# Altium project PPC_notebook_electrical_schematics_v0.6.PrjPcb (part 3 of 10)

## Sheet 09 USB.SchDoc
size 420 x 297 mm
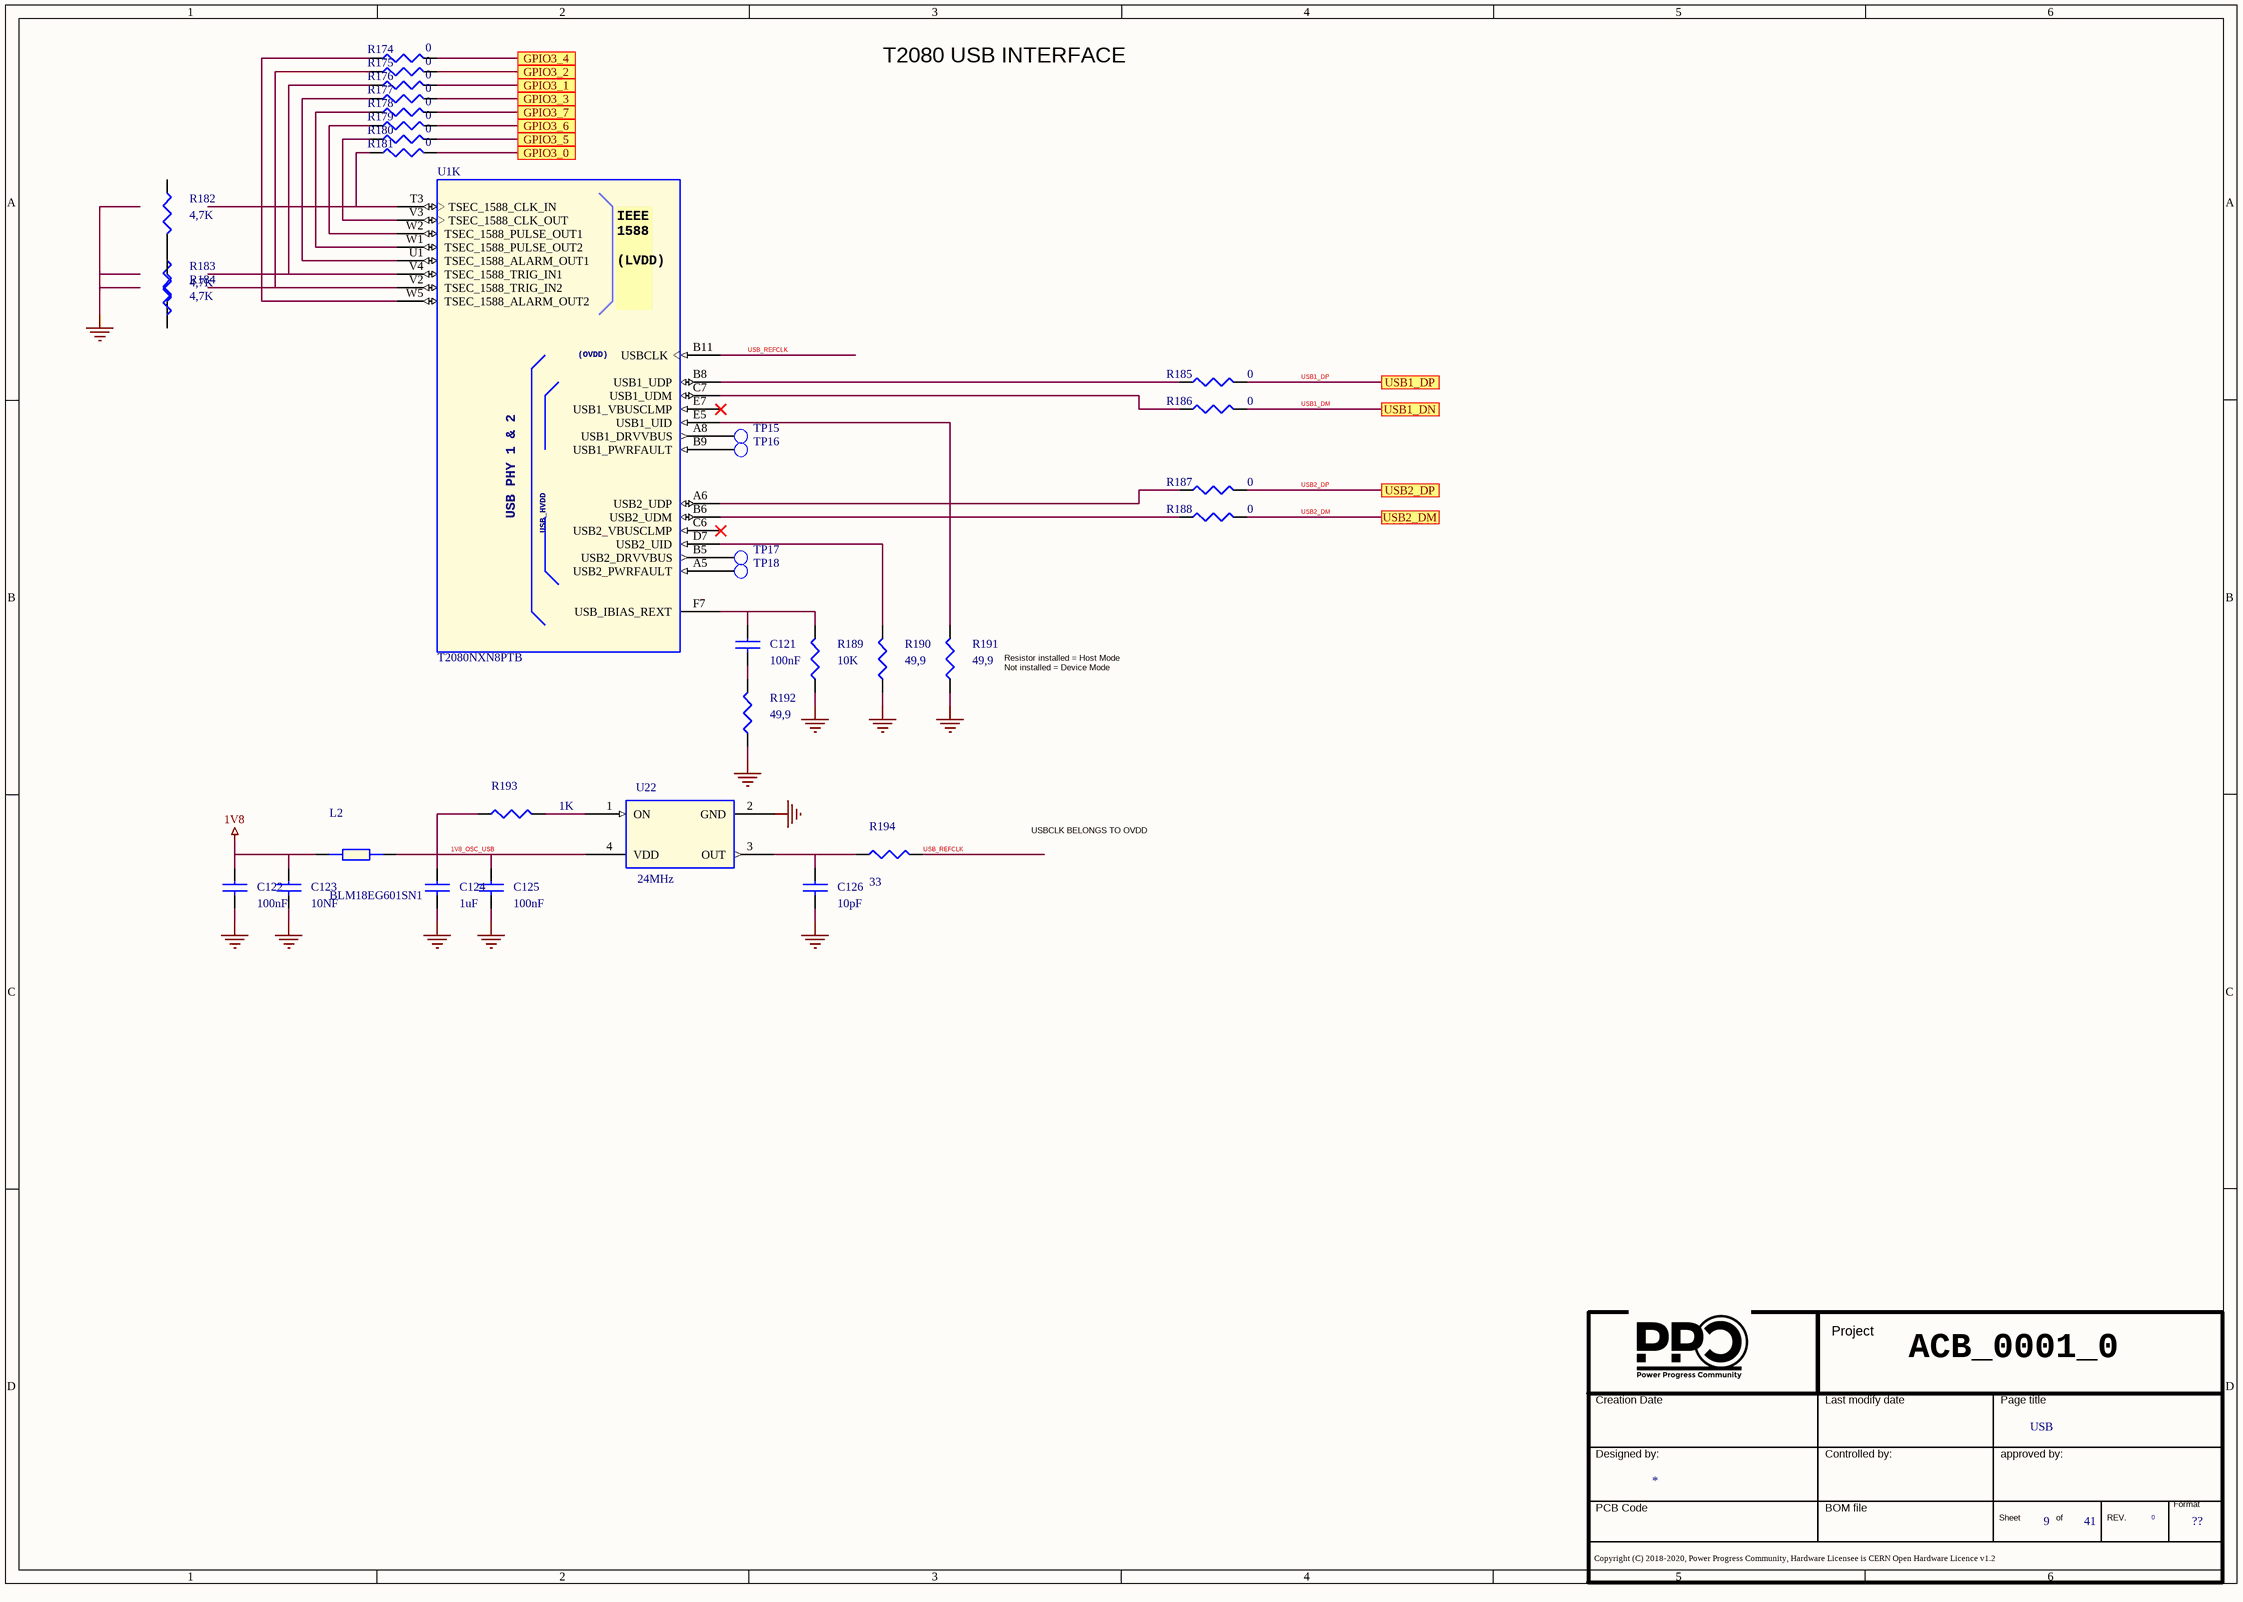
[diagram p20: 09 USB.SchDoc]

### Parts
(Parts that share a designator on the sheet are numbered #1, #2 ... from top to bottom, then left to right.)
*#13  Doc: USB  Page Count: 41  Page Number: 9  Page Size: ??  RevCode: 0  (hidden comment: Title_block_PPC)  (graphical)
C121  100nF  [SMD_0402]
C122  100nF  [SMD_0402]
C123  10NF  [SMD_0402]
C124  1uF  [SMD_0402]
C125  100nF  [SMD_0402]
C126  10pF  [SMD_0402]
L2  BLM18EG601SN1  [SMD_0603]
R174  0  [SMD_0402]
R175  0  [SMD_0402]
R176  0  [SMD_0402]
R177  0  [SMD_0402]
R178  0  [SMD_0402]
R179  0  [SMD_0402]
R180  0  [SMD_0402]
R181  0  [SMD_0402]
R182  4,7K  [SMD_0402]
R183  4,7K  [SMD_0402]
R184  4,7K  [SMD_0402]
R185  0  [SMD_0402]
R186  0  [SMD_0402]
R187  0  [SMD_0402]
R188  0  [SMD_0402]
R189  10K  [SMD_0402]
R190  49,9  [SMD_0402]
R191  49,9  [SMD_0402]
R192  49,9  [SMD_0402]
R193  1K  [SMD_0402]
R194  33  [SMD_0402]
TP15  TEST POINT  [PCB]  (value not drawn)
TP16  TEST POINT  [PCB]  (value not drawn)
TP17  TEST POINT  [PCB]  (value not drawn)
TP18  TEST POINT  [PCB]  (value not drawn)
U1  T2080NXN8PTB  [bga]  (part K of 14)
U22  24MHz  [4 PIN SMT]

### Ports
GPIO3_0, GPIO3_1, GPIO3_2, GPIO3_3, GPIO3_4, GPIO3_5, GPIO3_6, GPIO3_7, USB1_DN, USB1_DP, USB2_DM, USB2_DP

### Nets
1V8: C122.1 C123.1 L2.1
GND: C122.2 C123.2 C124.2 C125.2 C126.2 R189.1 R190.1 R191.1 R192.1 U22.2(GND)
1V8_OSC_USB: C124.1 C125.1 L2.2 R193.1 U22.4(VDD)
USB1_DM: R186.2 ; port USB1_DN
USB1_DP: R185.2 ; port USB1_DP
USB2_DM: R188.2 ; port USB2_DM
USB2_DP: R187.2 ; port USB2_DP
USB_REFCLK: R194.2 U1.B11(USBCLK)
NetC121_1: C121.1 R189.2 U1.F7(USB_IBIAS_REXT)
NetC121_2: C121.2 R192.2
NetC126_1: C126.1 R194.1 U22.3(OUT)
NetR174_1: R174.1 U1.W5(TSEC_1588_ALARM_OUT2)
NetR174_2: R174.2 ; port GPIO3_4
NetR175_1: R175.1 U1.V2(TSEC_1588_TRIG_IN2)
NetR175_2: R175.2 ; port GPIO3_2
NetR176_1: R176.1 U1.V4(TSEC_1588_TRIG_IN1)
NetR176_2: R176.2 ; port GPIO3_1
NetR177_1: R177.1 U1.U1(TSEC_1588_ALARM_OUT1)
NetR177_2: R177.2 ; port GPIO3_3
NetR178_1: R178.1 U1.W1(TSEC_1588_PULSE_OUT2)
NetR178_2: R178.2 ; port GPIO3_7
NetR179_1: R179.1 U1.W2(TSEC_1588_PULSE_OUT1)
NetR179_2: R179.2 ; port GPIO3_6
NetR180_1: R180.1 U1.V3(TSEC_1588_CLK_OUT)
NetR180_2: R180.2 ; port GPIO3_5
NetR181_1: R181.1 U1.T3(TSEC_1588_CLK_IN)
NetR181_2: R181.2 ; port GPIO3_0
NetR182_2: R182.2 R183.1
NetR185_1: R185.1 U1.B8(USB1_UDP)
NetR186_1: R186.1 U1.C7(USB1_UDM)
NetR187_1: R187.1 U1.A6(USB2_UDP)
NetR188_1: R188.1 U1.B6(USB2_UDM)
NetR190_2: R190.2 U1.D7(USB2_UID)
NetR191_2: R191.2 U1.E5(USB1_UID)
NetR193_2: R193.2 U22.1(ON)
NetTP15_1: TP15.1(TP) U1.A8(USB1_DRVVBUS)
NetTP16_1: TP16.1(TP) U1.B9(USB1_PWRFAULT)
NetTP17_1: TP17.1(TP) U1.B5(USB2_DRVVBUS)
NetTP18_1: TP18.1(TP) U1.A5(USB2_PWRFAULT)

Not connected (* = marked no-connect by the designer): R182 1; R183 2; R184 1 2; U1 C6(USB2_VBUSCLMP)* E7(USB1_VBUSCLMP)*

### Notes on the sheet
- T2080 USB INTERFACE
- Resistor installed = Host Mode
  Not installed = Device Mode
- USBCLK BELONGS TO OVDD
- ACB_0001_0
- (in symbol T2080, part K) IEEE 1588 / (LVDD); (OVDD); USB PHY 1 & 2; USB_HVDD

### Library data of the parts
*#13 = Title_block_PPC: Title: T2080PCIe; Schematic Page Count: 45; Schematic Page Number: 10; Author: MICETEK; Page Create Date: March  8, 1995; Page Title: ?; Page Modify Date: *
C121 = CAP NP_Dup2: as C74-C83 on sheet 07 SYS; Part Type: Capacitors\Ceramic\SMD\0402; PCB Footprint: SMD_0402
C122 C125 = CAP NP_Dup2: as C70-C73 on sheet 07 SYS; PCB Footprint: SMD_0402; Part Type: Capacitors\Ceramic\SMD\0402
C123 = CAP NP_Dup2: COND.CER. 10NF 16V 0402 X7R SMD; Part Number: PASSIVE_28; Manufacturer 1: AVX; Manufacturer Part Number 1: 0402YC103KAT2A; RSM: RC0402; Part Type: Capacitors\Ceramic\SMD\0402; PCB Footprint: SMD_0402
C124 = CAP NP_Dup2: CAP CER 1UF 25V X6S 0402; Part Number: PASSIVE_1446; Manufacturer 1: Murata; Manufacturer Part Number 1: GRM155C81E105KE11D; RSM: RC0402; Part Type: Capacitors\Ceramic\SMD\0402; PCB Footprint: SMD_0402
C126 = CAP NP_Dup2: COND.CER.10PF 50V 0402 NPO/COG SMD; Manufacturer Part Number 1: GRM1555C1H100JZ01D; Manufacturer 1: Murata; Part Number: PASSIVE_32; RSM: RC0402; Part Type: Capacitors\Ceramic\SMD\0402; PCB Footprint: SMD_0402
L2 = FERRITE_BEAD: as L3 on sheet 09A_USB_HUB; Part Type: Ferrite Beads\SMD\0603; PCB Footprint: SMD_0603
R174-R181 R185-R188 = R_Dup5: as R102 on sheet 07 SYS; Part Type: Resistors\Fixed\SMD\0402\5%; Manufacturer Part Number 1: RESIS.CHIP 0R 5% 0402 SMD; PCB Footprint: SMD_0402
  R174-R181: Distributor 1: CAMEL ELETTRONICA SRL  #
R182-R184 = R_Dup5: as R77-R94 on sheet 07 SYS; Part Type: Resistors\Fixed\SMD\0402\5%; PCB Footprint: SMD_0402; Manufacturer Part Number 1: RESIS.CHIP 4,7K 5% 0402 SMD
R189 = R_Dup5: as R114 on sheet 07 SYS; Manufacturer Part Number 1: RESIS.CHIP 10K 1% 0402 SMD; Part Type: Resistors\Fixed\SMD\0402\1%; PCB Footprint: SMD_0402
R190-R192 = R_Dup5: RESIS.CHIP 49,9R 1% 0402 SMD; Manufacturer Part Number 1: NCR04F49R9TRF; Manufacturer 1: NIC; Part Number: PASSIVE_738; RSM: RC0402; Part Type: Resistors\Fixed\SMD\0402\1%; PCB Footprint: SMD_0402
R193 = R_Dup5: as R97 on sheet 07 SYS; Part Type: Resistors\Fixed\SMD\0402\1%; Manufacturer Part Number 1: RESIS.CHIP 1K 1% 0402 SMD; PCB Footprint: SMD_0402
R194 = R_Dup5: RESIS.CHIP 33R 5% 0402 SMD; Part Number: PASSIVE_853; Manufacturer 1: ROYAL OHM; RSM: RC0402; Part Type: Resistors\Fixed\SMD\0402\5%; Manufacturer Part Number 1: RESIS.CHIP 33R 5% 0402 SMD; PCB Footprint: SMD_0402
TP15-TP18 = T POINT R: as TP19-TP21 on sheet 09B KEYBOARD; PCB Footprint: PCB; Part Type: Tpoint
U1 = T2080: QRIQ MPU 1.87GT/s DDR3/3L 4x10GE; Manufacturer 1: NXP; Part Number: MICROPROCESSOR_65; PCB Footprint: BGA896; Vendor: Freescale; RSM: PBGA896-0_8MM-26X25; Distributor 1: MOUSER(841-T2080NXN8PTB); Manufacturer Part Number 1: T2080NXN8PTB; Part Type: 32 BIT; TYPE: IC; MPN: T2080
U22 = OSCILLATOR: OSCILLATOR 24.000MHZ 1.8-3.3V 50ppm SMD; Part Number: MISC_87; Manufacturer 1: ABRACOM; Manufacturer Part Number 1: ASFLMB-24.000MHZ-LC-T; PCB Footprint: SMD_5.0x3.2; RSM: XC-ABM3B; Part Type: Oscillator; Distributor 1: DIGIKEY(535-11768-1-ND)

## Sheet 10B_WRAPPER.SchDoc
size 420 x 297 mm
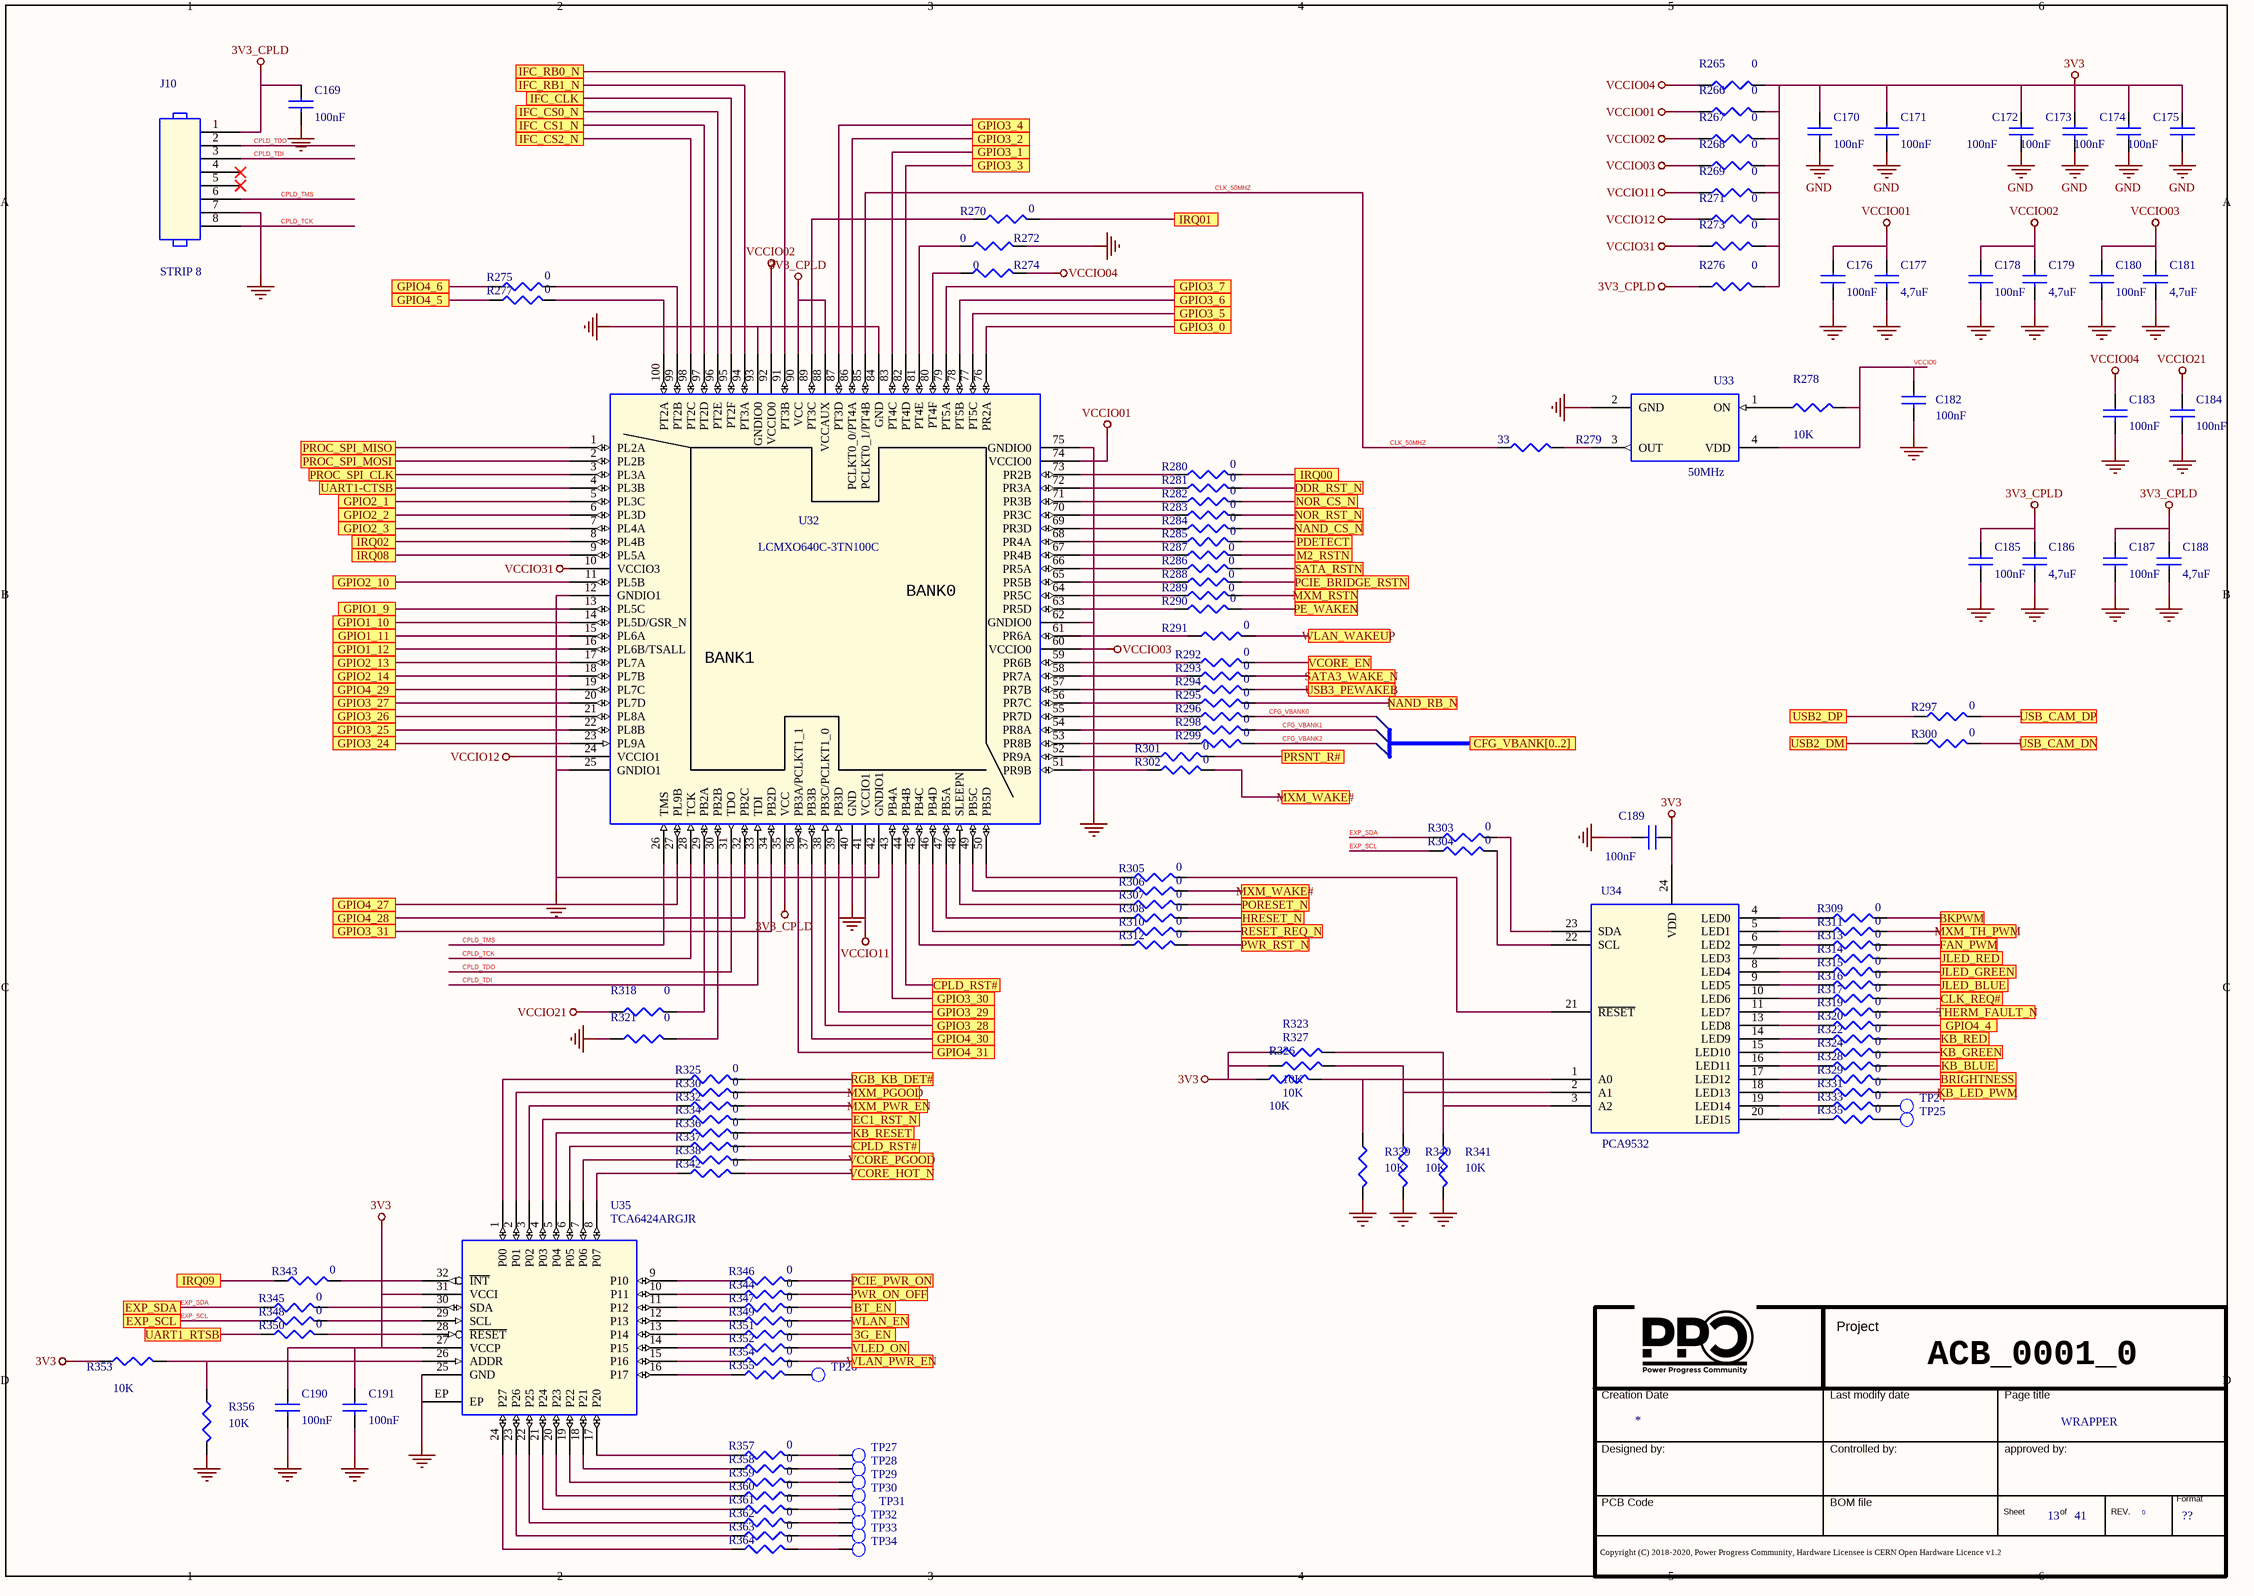
[diagram p21: 10B_WRAPPER.SchDoc]

### Parts
(Parts that share a designator on the sheet are numbered #1, #2 ... from top to bottom, then left to right.)
*#14  Doc: WRAPPER  Page Count: 41  Page Number: 13  Page Size: ??  RevCode: 0  (hidden comment: Title_block_PPC)  (graphical)
C169  100nF  [SMD_0402]
C170  100nF  [SMD_0402]
C171  100nF  [SMD_0402]
C172  100nF  [SMD_0402]
C173  100nF  [SMD_0402]
C174  100nF  [SMD_0402]
C175  100nF  [SMD_0402]
C176  100nF  [SMD_0402]
C177  4,7uF  [SMD_0603]
C178  100nF  [SMD_0402]
C179  4,7uF  [SMD_0603]
C180  100nF  [SMD_0402]
C181  4,7uF  [SMD_0603]
C182  100nF  [SMD_0402]
C183  100nF  [SMD_0402]
C184  100nF  [SMD_0402]
C185  100nF  [SMD_0402]
C186  4,7uF  [SMD_0603]
C187  100nF  [SMD_0402]
C188  4,7uF  [SMD_0603]
C189  100nF  [SMD_0402]
C190  100nF  [SMD_0402]
C191  100nF  [SMD_0402]
J10  STRIP 8  [PTH]
R265  0  [SMD_0402]
R266  0  [SMD_0402]
R267  0  [SMD_0402]
R268  0  [SMD_0402]
R269  0  [SMD_0402]
R270  0  [SMD_0402]
R271  0  [SMD_0402]
R272  0  [SMD_0402]
R273  0  [SMD_0402]
R274  0  [SMD_0402]
R275  0  [SMD_0402]
R276  0  [SMD_0402]
R277  0  [SMD_0402]
R278  10K  [SMD_0402]
R279  33  [SMD_0402]
R280  0  [SMD_0402]
R281  0  [SMD_0402]
R282  0  [SMD_0402]
R283  0  [SMD_0402]
R284  0  [SMD_0402]
R285  0  [SMD_0402]
R286  0  [SMD_0402]
R287  0  [SMD_0402]
R288  0  [SMD_0402]
R289  0  [SMD_0402]
R290  0  [SMD_0402]
R291  0  [SMD_0402]
R292  0  [SMD_0402]
R293  0  [SMD_0402]
R294  0  [SMD_0402]
R295  0  [SMD_0402]
R296  0  [SMD_0402]
R297  0  [SMD_0402]
R298  0  [SMD_0402]
R299  0  [SMD_0402]
R300  0  [SMD_0402]
R301  0  [SMD_0402]
R302  0  [SMD_0402]
R303  0  [SMD_0402]
R304  0  [SMD_0402]
R305  0  [SMD_0402]
R306  0  [SMD_0402]
R307  0  [SMD_0402]
R308  0  [SMD_0402]
R309  0  [SMD_0402]
R310  0  [SMD_0402]
R311  0  [SMD_0402]
R312  0  [SMD_0402]
R313  0  [SMD_0402]
R314  0  [SMD_0402]
R315  0  [SMD_0402]
R316  0  [SMD_0402]
R317  0  [SMD_0402]
R318  0  [SMD_0402]
R319  0  [SMD_0402]
R320  0  [SMD_0402]
R321  0  [SMD_0402]
R322  0  [SMD_0402]
R323  10K  [SMD_0402]
R324  0  [SMD_0402]
R325  0  [SMD_0402]
R326  10K  [SMD_0402]
R327  10K  [SMD_0402]
R328  0  [SMD_0402]
R329  0  [SMD_0402]
R330  0  [SMD_0402]
R331  0  [SMD_0402]
R332  0  [SMD_0402]
R333  0  [SMD_0402]
R334  0  [SMD_0402]
R335  0  [SMD_0402]
R336  0  [SMD_0402]
R337  0  [SMD_0402]
R338  0  [SMD_0402]
R339  10K  [SMD_0402]
R340  10K  [SMD_0402]
R341  10K  [SMD_0402]
R342  0  [SMD_0402]
R343  0  [SMD_0402]
R344  0  [SMD_0402]
R345  0  [SMD_0402]
R346  0  [SMD_0402]
R347  0  [SMD_0402]
R348  0  [SMD_0402]
R349  0  [SMD_0402]
R350  0  [SMD_0402]
R351  0  [SMD_0402]
R352  0  [SMD_0402]
R353  10K  [SMD_0402]
R354  0  [SMD_0402]
R355  0  [SMD_0402]
R356  10K  [SMD_0402]
R357  0  [SMD_0402]
R358  0  [SMD_0402]
R359  0  [SMD_0402]
R360  0  [SMD_0402]
R361  0  [SMD_0402]
R362  0  [SMD_0402]
R363  0  [SMD_0402]
R364  0  [SMD_0402]
TP24  TEST POINT  [PCB]  (value not drawn)
TP25  TEST POINT  [PCB]  (value not drawn)
TP26  TEST POINT  [PCB]  (value not drawn)
TP27  TEST POINT  [PCB]  (value not drawn)
TP28  TEST POINT  [PCB]  (value not drawn)
TP29  TEST POINT  [PCB]  (value not drawn)
TP30  TEST POINT  [PCB]  (value not drawn)
TP31  TEST POINT  [PCB]  (value not drawn)
TP32  TEST POINT  [PCB]  (value not drawn)
TP33  TEST POINT  [PCB]  (value not drawn)
TP34  TEST POINT  [PCB]  (value not drawn)
U32  LCMXO640C-3TN100C  [TQFP-100]
U33  50MHz  [4 PIN SMT]
U34  PCA9532  [TSSOP24]
U35  TCA6424ARGJR  [QFN32]

### Ports
3G_EN, BKPWM, BRIGHTNESS, BT_EN, CFG_VBANK[0..2], CLK_REQ#, CPLD_RST#, DDR_RST_N, EC1_RST_N, EXP_SCL, EXP_SDA, FAN_PWM, GPIO1_9, GPIO1_10, GPIO1_11, GPIO1_12, GPIO2_1, GPIO2_2, GPIO2_3, GPIO2_10, GPIO2_13, GPIO2_14, GPIO3_0, GPIO3_1, GPIO3_2, GPIO3_3, GPIO3_4, GPIO3_5, GPIO3_6, GPIO3_7, GPIO3_24, GPIO3_25, GPIO3_26, GPIO3_27, GPIO3_28, GPIO3_29, GPIO3_30, GPIO3_31, GPIO4_4, GPIO4_5, GPIO4_6, GPIO4_27, GPIO4_28, GPIO4_29, GPIO4_30, GPIO4_31, HRESET_N, IFC_CLK, IFC_CS0_N, IFC_CS1_N, IFC_CS2_N, IFC_RB0_N, IFC_RB1_N, IRQ00, IRQ01, IRQ02, IRQ08, IRQ09, JLED_BLUE, JLED_GREEN, JLED_RED, KB_BLUE, KB_GREEN, KB_LED_PWM, KB_RED, KB_RESET, M2_RSTN, MXM_PGOOD, MXM_PWR_EN, MXM_RSTN, MXM_TH_PWM, MXM_WAKE#, NAND_CS_N, NAND_RB_N, NOR_CS_N, NOR_RST_N, PCIE_BRIDGE_RSTN, PCIE_PWR_ON, PDETECT, PE_WAKEN, PORESET_N, PROC_SPI_CLK, PROC_SPI_MISO, PROC_SPI_MOSI, PRSNT_R#, PWR_ON_OFF, PWR_RST_N, RESET_REQ_N, RGB_KB_DET#, SATA3_WAKE_N, SATA_RSTN, THERM_FAULT_N, UART1-CTSB, UART1_RTSB, USB2_DM, USB2_DP, USB3_PEWAKEB, USB_CAM_DN, USB_CAM_DP, VCORE_EN, VCORE_HOT_N, VCORE_PGOOD, VLED_ON, WLAN_EN, WLAN_PWR_EN, WLAN_WAKEUP

### Nets
3V3: C170.1 C171.1 C172.1 C173.1 C174.1 C175.1 C189.1 C190.1 C191.1 R265.2 R266.2 R267.2 R268.2 R269.2 R271.2 R273.2 R276.2 R323.1 R326.1 R327.1 R353.1 U34.24(VDD) U35.27(VCCP) U35.31(VCCI)
3V3_CPLD: C169.1 C185.1 C186.1 C187.1 C188.1 J10.1 R276.1 U32.35(VCC) U32.88(VCCAUX) U32.90(VCC)
GND: C170.2 C171.2 C172.2 C173.2 C174.2 C175.2 C182.2 C189.2 C190.2 C191.2 R339.2 R340.2 R341.2 R356.2 U33.2(GND) U35.25(GND) U35.EP
GND_SIGNAL: C169.2 C176.2 C177.2 C178.2 C179.2 C180.2 C181.2 C183.2 C184.2 C185.2 C186.2 C187.2 C188.2 J10.7 R272.1 R321.1 U32.12(GNDIO1) U32.25(GNDIO1) U32.40(GND) U32.42(GNDIO1) U32.62(GNDIO0) U32.75(GNDIO0) U32.84(GND) U32.93(GNDIO0)
VCCIO01: C176.1 C177.1 R266.1 U32.74(VCCIO0)
VCCIO02: C178.1 C179.1 R267.1 U32.92(VCCIO0)
VCCIO03: C180.1 C181.1 R268.1 U32.60(VCCIO0)
VCCIO04: C183.1 R265.1 R274.1
VCCIO11: R269.1 U32.41(VCCIO1)
VCCIO12: R271.1 U32.24(VCCIO1)
VCCIO21: C184.1 R318.1
VCCIO31: R273.1 U32.10(VCCIO3)
CFG_VBANK0: R296.2
CFG_VBANK1: R298.2
CFG_VBANK2: R299.2
CLK_50MHZ: R279.2 U32.85(PCLKT0_1/PT4B)
CPLD_TCK: J10.8 U32.28(TCK)
CPLD_TDI: J10.3 U32.33(TDI)
CPLD_TDO: J10.2 U32.31(TDO)
CPLD_TMS: J10.6 U32.26(TMS)
EXP_SCL: R304.1 R348.1 ; port EXP_SCL
EXP_SDA: R303.1 R345.1 ; port EXP_SDA
PCIE_PWR_ON: R346.2 ; port PCIE_PWR_ON
PROC_SPI_CLK: U32.3(PL3A) ; port PROC_SPI_CLK
PROC_SPI_MISO: U32.1(PL2A) ; port PROC_SPI_MISO
PROC_SPI_MOSI: U32.2(PL2B) ; port PROC_SPI_MOSI
USB2_DM: R300.1 ; port USB2_DM
USB2_DP: R297.1 ; port USB2_DP
VCCIO0: C182.1 R278.1 U33.4(VDD)
WAKE_N: R293.2 ; port SATA3_WAKE_N
NetD6_3: R334.2 ; port EC1_RST_N
NetJ3F1_30: R281.2 ; port DDR_RST_N
NetJ15_54: R347.2 ; port BT_EN
NetJ15_56: R349.2 ; port WLAN_EN
NetJ20_17: R329.2 ; port BRIGHTNESS
NetJ20_19: R352.2 ; port VLED_ON
NetM3_1: R322.2 ; port KB_RED
NetM4_1: R331.2 ; port KB_LED_PWM
NetM5_1: R324.2 ; port KB_GREEN
NetM6_1: R328.2 ; port KB_BLUE
NetM7_1: R314.2 ; port JLED_RED
NetM8_1: R315.2 ; port JLED_GREEN
NetM9_1: R316.2 ; port JLED_BLUE
NetQ21_1: R313.2 ; port FAN_PWM
NetR30_1: U32.98(PT2C) ; port IFC_CS2_N
NetR31_1: U32.96(PT2E) ; port IFC_CS0_N
NetR32_2: U32.97(PT2D) ; port IFC_CS1_N
NetR38_1: U32.94(PT3A) ; port IFC_RB1_N
NetR39_1: U32.91(PT3B) ; port IFC_RB0_N
NetR49_2: U32.95(PT2F) ; port IFC_CLK
NetR50_1: R282.2 ; port NOR_CS_N
NetR54_1: R284.2 ; port NAND_CS_N
NetR55_1: R283.2 ; port NOR_RST_N
NetR56_1: R295.2 ; port NAND_RB_N
NetR77_1: R310.2 ; port RESET_REQ_N
NetR78_1: R308.2 ; port HRESET_N
NetR79_1: R307.2 ; port PORESET_N
NetR83_1: R280.2 ; port IRQ00
NetR87_1: R343.1 ; port IRQ09
NetR88_2: U32.9(PL5A) ; port IRQ08
NetR93_1: U32.8(PL4B) ; port IRQ02
NetR94_1: R270.2 ; port IRQ01
NetR139_2: U32.19(PL7C) ; port GPIO4_29
NetR140_2: U32.20(PL7D) ; port GPIO3_27
NetR141_2: U32.21(PL8A) ; port GPIO3_26
NetR142_2: U32.22(PL8B) ; port GPIO3_25
NetR143_2: U32.23(PL9A) ; port GPIO3_24
NetR144_2: U32.27(PL9B) ; port GPIO4_27
NetR145_2: U32.32(PB2C) ; port GPIO4_28
NetR148_2: U32.34(PB2D) ; port GPIO3_31
NetR149_2: U32.43(PB4A) ; port GPIO3_30
NetR150_2: U32.37(PB3B) ; port GPIO4_30
NetR151_2: U32.39(PB3D) ; port GPIO3_29
NetR152_2: U32.38(PB3C/PCLKT1_0) ; port GPIO3_28
NetR153_2: U32.36(PB3A/PCLKT1_1) ; port GPIO4_31
NetR174_2: U32.87(PT3D) ; port GPIO3_4
NetR175_2: U32.86(PCLKT0_0/PT4A) ; port GPIO3_2
NetR176_2: U32.83(PT4C) ; port GPIO3_1
NetR177_2: U32.82(PT4D) ; port GPIO3_3
NetR178_2: U32.79(PT5A) ; port GPIO3_7
NetR179_2: U32.78(PT5B) ; port GPIO3_6
NetR180_2: U32.77(PT5C) ; port GPIO3_5
NetR181_2: U32.76(PR2A) ; port GPIO3_0
NetR216_2: R336.2 ; port KB_RESET
NetR224_2: R325.2 ; port RGB_KB_DET#
NetR244_1: R350.1 ; port UART1_RTSB
NetR245_1: U32.4(PL3B) ; port UART1-CTSB
NetR263_1: R319.2 ; port THERM_FAULT_N
NetR270_1: R270.1 U32.89(PT3C)
NetR272_2: R272.2 U32.81(PT4E)
NetR274_2: R274.2 U32.80(PT4F)
NetR275_1: R275.1 ; port GPIO4_6
NetR275_2: R275.2 U32.99(PT2B)
NetR277_1: R277.1 ; port GPIO4_5
NetR277_2: R277.2 U32.100(PT2A)
NetR278_2: R278.2 U33.1(ON)
NetR279_1: R279.1 U33.3(OUT)
NetR280_1: R280.1 U32.73(PR2B)
NetR281_1: R281.1 U32.72(PR3A)
NetR282_1: R282.1 U32.71(PR3B)
NetR283_1: R283.1 U32.70(PR3C)
NetR284_1: R284.1 U32.69(PR3D)
NetR285_1: R285.1 U32.68(PR4A)
NetR285_2: R285.2 ; port PDETECT
NetR286_1: R286.1 U32.66(PR5A)
NetR286_2: R286.2 ; port SATA_RSTN
NetR287_1: R287.1 U32.67(PR4B)
NetR287_2: R287.2 ; port M2_RSTN
NetR288_1: R288.1 U32.65(PR5B)
NetR288_2: R288.2 ; port PCIE_BRIDGE_RSTN
NetR289_1: R289.1 U32.64(PR5C)
NetR289_2: R289.2 ; port MXM_RSTN
NetR290_1: R290.1 U32.63(PR5D)
NetR290_2: R290.2 ; port PE_WAKEN
NetR291_1: R291.1 U32.61(PR6A)
NetR291_2: R291.2 ; port WLAN_WAKEUP
NetR292_1: R292.1 U32.59(PR6B)
NetR292_2: R292.2 ; port VCORE_EN
NetR293_1: R293.1 U32.58(PR7A)
NetR294_1: R294.1 U32.57(PR7B)
NetR294_2: R294.2 ; port USB3_PEWAKEB
NetR295_1: R295.1 U32.56(PR7C)
NetR296_1: R296.1 U32.55(PR7D)
NetR297_2: R297.2 ; port USB_CAM_DP
NetR298_1: R298.1 U32.54(PR8A)
NetR299_1: R299.1 U32.53(PR8B)
NetR300_2: R300.2 ; port USB_CAM_DN
NetR301_1: R301.1 U32.52(PR9A)
NetR301_2: R301.2 ; port PRSNT_R#
NetR302_1: R302.1 U32.51(PR9B)
NetR302_2: R302.2 R306.2 ; port MXM_WAKE#
NetR303_2: R303.2 U34.23(SDA)
NetR304_2: R304.2 U34.22(SCL)
NetR305_1: R305.1 U32.50(PB5D)
NetR305_2: R305.2 U34.21(~{RESET})
NetR306_1: R306.1 U32.49(PB5C)
NetR307_1: R307.1 U32.48(SLEEPN)
NetR308_1: R308.1 U32.47(PB5A)
NetR309_1: R309.1 U34.4(LED0)
NetR309_2: R309.2 ; port BKPWM
NetR310_1: R310.1 U32.46(PB4D)
NetR311_1: R311.1 U34.5(LED1)
NetR311_2: R311.2 ; port MXM_TH_PWM
NetR312_1: R312.1 U32.45(PB4C)
NetR312_2: R312.2 ; port PWR_RST_N
NetR313_1: R313.1 U34.6(LED2)
NetR314_1: R314.1 U34.7(LED3)
NetR315_1: R315.1 U34.8(LED4)
NetR316_1: R316.1 U34.9(LED5)
NetR317_1: R317.1 U34.10(LED6)
NetR317_2: R317.2 ; port CLK_REQ#
NetR318_2: R318.2 U32.29(PB2A)
NetR319_1: R319.1 U34.11(LED7)
NetR320_1: R320.1 U34.13(LED8)
NetR320_2: R320.2 ; port GPIO4_4
NetR321_2: R321.2 U32.30(PB2B)
NetR322_1: R322.1 U34.14(LED9)
NetR323_2: R323.2 R341.1 U34.3(A2)
NetR324_1: R324.1 U34.15(LED10)
NetR325_1: R325.1 U35.1(P00)
NetR326_2: R326.2 R339.1 U34.1(A0)
NetR327_2: R327.2 R340.1 U34.2(A1)
NetR328_1: R328.1 U34.16(LED11)
NetR329_1: R329.1 U34.17(LED12)
NetR330_1: R330.1 U35.2(P01)
NetR330_2: R330.2 ; port MXM_PGOOD
NetR331_1: R331.1 U34.18(LED13)
NetR332_1: R332.1 U35.3(P02)
NetR332_2: R332.2 ; port MXM_PWR_EN
NetR333_1: R333.1 U34.19(LED14)
NetR333_2: R333.2 TP24.1(TP)
NetR334_1: R334.1 U35.4(P03)
NetR335_1: R335.1 U34.20(LED15)
NetR335_2: R335.2 TP25.1(TP)
NetR336_1: R336.1 U35.5(P04)
NetR337_1: R337.1 U35.6(P05)
NetR337_2: R337.2 U32.44(PB4B) ; port CPLD_RST#
NetR338_1: R338.1 U35.7(P06)
NetR338_2: R338.2 ; port VCORE_PGOOD
NetR342_1: R342.1 U35.8(P07)
NetR342_2: R342.2 ; port VCORE_HOT_N
NetR343_2: R343.2 U35.32(~{INT})
NetR344_1: R344.1 U35.10(P11)
NetR344_2: R344.2 ; port PWR_ON_OFF
NetR345_2: R345.2 U35.30(SDA)
NetR346_1: R346.1 U35.9(P10)
NetR347_1: R347.1 U35.11(P12)
NetR348_2: R348.2 U35.29(SCL)
NetR349_1: R349.1 U35.12(P13)
NetR350_2: R350.2 U35.28(~{RESET})
NetR351_1: R351.1 U35.13(P14)
NetR351_2: R351.2 ; port 3G_EN
NetR352_1: R352.1 U35.14(P15)
NetR353_2: R353.2 R356.1 U35.26(ADDR)
NetR354_1: R354.1 U35.15(P16)
NetR354_2: R354.2 ; port WLAN_PWR_EN
NetR355_1: R355.1 U35.16(P17)
NetR355_2: R355.2 TP26.1(TP)
NetR357_1: R357.1 U35.17(P20)
NetR357_2: R357.2 TP27.1(TP)
NetR358_1: R358.1 U35.18(P21)
NetR358_2: R358.2 TP28.1(TP)
NetR359_1: R359.1 U35.19(P22)
NetR359_2: R359.2 TP29.1(TP)
NetR360_1: R360.1 U35.20(P23)
NetR360_2: R360.2 TP30.1(TP)
NetR361_1: R361.1 U35.21(P24)
NetR361_2: R361.2 TP31.1(TP)
NetR362_1: R362.1 U35.22(P25)
NetR362_2: R362.2 TP32.1(TP)
NetR363_1: R363.1 U35.23(P26)
NetR363_2: R363.2 TP33.1(TP)
NetR364_1: R364.1 U35.24(P27)
NetR364_2: R364.2 TP34.1(TP)
NetU1_A17: U32.18(PL7B) ; port GPIO2_14
NetU1_B17: U32.11(PL5B) ; port GPIO2_10
NetU1_C18: U32.14(PL5D/GSR_N) ; port GPIO1_10
NetU1_D21: U32.15(PL6A) ; port GPIO1_11
NetU1_E19: U32.13(PL5C) ; port GPIO1_9
NetU1_F18: U32.17(PL7A) ; port GPIO2_13
NetU1_G19: U32.16(PL6B/TSALL) ; port GPIO1_12
NetU1_H5: U32.6(PL3D) ; port GPIO2_2
NetU1_K6: U32.5(PL3C) ; port GPIO2_1
NetU1_L6: U32.7(PL4A) ; port GPIO2_3

Not connected (* = marked no-connect by the designer): J10 4* 5*

### Notes on the sheet
- (near U32) BANK0
- (near U32) BANK1
- ACB_0001_0

### Library data of the parts
*#14 = Title_block_PPC: Title: T2080PCIe; Schematic Page Count: 45; Schematic Page Number: 15; Author: MICETEK; Page Create Date: March  8, 1995; Page Title: ?; Page Modify Date: *
C169-C173 C178 C180 C189-C191 = CAP NP_Dup3: COND.CER. 100NF 50V 0402 X7R SMD; Manufacturer Part Number 1: CGA2B3X7R1H104M050BD; Manufacturer 1: TDK; Part Number: PASSIVE_24; RSM: RC0402; Distributor 1: MURATA ELETTRONICA SPA; Part Type: Capacitors\Ceramic\SMD\0402; PCB Footprint: SMD_0402
C174-C176 C183-C185 C187 = CAP NP_Dup3: COND.CER. 100NF 50V 0402 X7R SMD; Part Number: PASSIVE_24; Manufacturer 1: TDK; Manufacturer Part Number 1: CGA2B3X7R1H104M050BD; RSM: RC0402; Part Type: Capacitors\Ceramic\SMD\0402; Distributor 1: MURATA ELETTRONICA SPA; PCB Footprint: SMD_0402
C177 C186 C188 = CAP NP_Dup3: COND.CER.4,7uF 16V X5R 0603 SMD; Part Number: PASSIVE_1405; Manufacturer 1: SAMSUNG; Manufacturer Part Number 1: CL10A475KO8NNNC; RSM: RC0603; Part Type: Capacitors\Ceramic\SMD\0603; Distributor 1: DIGIKEY (445-8023-1-ND); PCB Footprint: SMD_0603
C179 C181 = CAP NP_Dup3: COND.CER.4,7uF 16V X5R 0603 SMD; Manufacturer Part Number 1: CL10A475KO8NNNC; Manufacturer 1: SAMSUNG; Part Number: PASSIVE_1405; RSM: RC0603; Distributor 1: DIGIKEY (445-8023-1-ND); Part Type: Capacitors\Ceramic\SMD\0603; PCB Footprint: SMD_0603
C182 = CAP NP_Dup4: COND.CER. 100NF 50V 0402 X7R SMD; Manufacturer Part Number 1: CGA2B3X7R1H104M050BD; Manufacturer 1: TDK; Part Number: PASSIVE_24; LNK_PART: C0402; RSM: RC0402; Distributor 1: MURATA ELETTRONICA SPA; Part Type: Capacitors\Ceramic\SMD\0402; PCB Footprint: SMD_0402
J10 = HEADER_8: STRIP MASC.1x8P CS.p=2.54mm; Manufacturer Part Number 1: TSW-108-24-T-S; Manufacturer 1: Samtec; Part Number: CONNECTORS_464; RSM: PIN-100MLS-8; PCB Footprint: PTH; Distributor 1: CLAITRON LASI SILVESTAR S.R.L.; Part Type: Strip\Terminal
R265-R269 R271 R273 R286-R289 R318 = R_Dup4: RESIS.CHIP 0R 5% 0402 SMD; Part Number: PASSIVE_805; Manufacturer 1: ROYAL OHM; RSM: RC0402; Part Type: Resistors\Fixed\SMD\0402\5%; Manufacturer Part Number 1: RESIS.CHIP 0R 5% 0402 SMD; Distributor 1: CAMEL ELETTRONICA SRL  #; PCB Footprint: SMD_0402
R270 R280-R285 R291-R299 R301 R302 R305-R317 R319 R320 R322 R324 R325 R328-R338 R342 R350 = R_Dup5: RESIS.CHIP 0R 5% 0402 SMD; Part Number: PASSIVE_805; Manufacturer 1: ROYAL OHM; RSM: RC0402; PCB Footprint: SMD_0402; Part Type: Resistors\Fixed\SMD\0402\5%; Manufacturer Part Number 1: RESIS.CHIP 0R 5% 0402 SMD; Distributor 1: CAMEL ELETTRONICA SRL  #
R272 R274 R276 R321 = R_Dup4: RESIS.CHIP 0R 5% 0402 SMD; Manufacturer 1: ROYAL OHM; Part Number: PASSIVE_805; RSM: RC0402; Distributor 1: CAMEL ELETTRONICA SRL  #; Manufacturer Part Number 1: RESIS.CHIP 0R 5% 0402 SMD; Part Type: Resistors\Fixed\SMD\0402\5%; PCB Footprint: SMD_0402
R275 R277 R290 R300 R303 R304 R343-R349 R351 R352 R354 R355 R357-R364 = R_Dup5: RESIS.CHIP 0R 5% 0402 SMD; Manufacturer 1: ROYAL OHM; Part Number: PASSIVE_805; RSM: RC0402; Distributor 1: CAMEL ELETTRONICA SRL  #; Manufacturer Part Number 1: RESIS.CHIP 0R 5% 0402 SMD; Part Type: Resistors\Fixed\SMD\0402\5%; PCB Footprint: SMD_0402
R278 R323 R326 R327 R339-R341 R356 = R_Dup5: RESIS.CHIP 10K 1% 0402 SMD; Part Number: PASSIVE_584; Manufacturer 1: ROYAL OHM; RSM: RC0402; Part Type: Resistors\Fixed\SMD\0402\1%; PCB Footprint: SMD_0402; Manufacturer Part Number 1: RESIS.CHIP 10K 1% 0402 SMD
R279 = R_Dup4: RESIS.CHIP 33R 5% 0402 SMD; Part Number: PASSIVE_853; Manufacturer 1: ROYAL OHM; RSM: RC0402; Part Type: Resistors\Fixed\SMD\0402\5%; Manufacturer Part Number 1: RESIS.CHIP 33R 5% 0402 SMD; Distributor 1: CAMEL ELETTRONICA SRL  #; PCB Footprint: SMD_0402
R353 = R_Dup5: RESIS.CHIP 10K 1% 0402 SMD; Manufacturer 1: ROYAL OHM; Part Number: PASSIVE_584; RSM: RC0402; Manufacturer Part Number 1: RESIS.CHIP 10K 1% 0402 SMD; Part Type: Resistors\Fixed\SMD\0402\1%; PCB Footprint: SMD_0402
TP24-TP34 = T POINT R: TEST POINT SU PCB; Part Number: CONNECTORS_542; RSM: AE-TESTPOINT; PCB Footprint: PCB; Part Type: Tpoint
U32 = LCMXO256: CPLD 640 LUTS 74 I/O 100 TQFP; Part Number: LOGIC_349; Manufacturer 1: LATTICE; Manufacturer Part Number 1: LCMXO640C-3TN100C / LCMXO256C-3TN100C; PCB Footprint: 100-LQFP; RSM: LQFP-100; Part Type: CPLD; Distributor 1: MOUSER(842-MXO640C3TN100C)
U33 = OSCILLATOR_Dup1: Oscillator 50Mhz SMD 3.2x2.5mm 4 Pads 1.8V; Manufacturer Part Number 1: ASE3-50.000MHZ-KT; Manufacturer 1: ABRACOM; Part Number: MISC_104; PCB Footprint: SMD_3.2x2.5; RSM: XC-CTS-632; Distributor 1: DIGIKEY(535-9554-1-ND); Part Type: Oscillator
U34 = PCA9532_0: LED DRIVER, PWM, 400KHZ, TSSOP-24; Part Number: LOGIC_114; Manufacturer 1: NXP; Manufacturer Part Number 1: PCA9532PW,112; PCB Footprint: 24-TSSOP; Part Type: I2C\EXPANDERS; Distributor 1: FARNELL(2400469); RSM: TSSOP-24
U35 = TCA6424A_0: I/O Expander 24 I²C, SMBus 32-UQFN; Manufacturer: TI; Manufacturer 1: TEXAS; Part Number: LOGIC_119; RSM: QFN-32-EP; Manufacturer p/n: TCA6424ARGJR; PCB Footprint: 32-UQFN; Distributor 1: DIGIKEY( 	296-27844-1-ND); Manufacturer Part Number 1: TCA6424ARGJR; Part Type: I2C\EXPANDERS

## Sheet 10 UART&I2C.SchDoc
size 420 x 297 mm
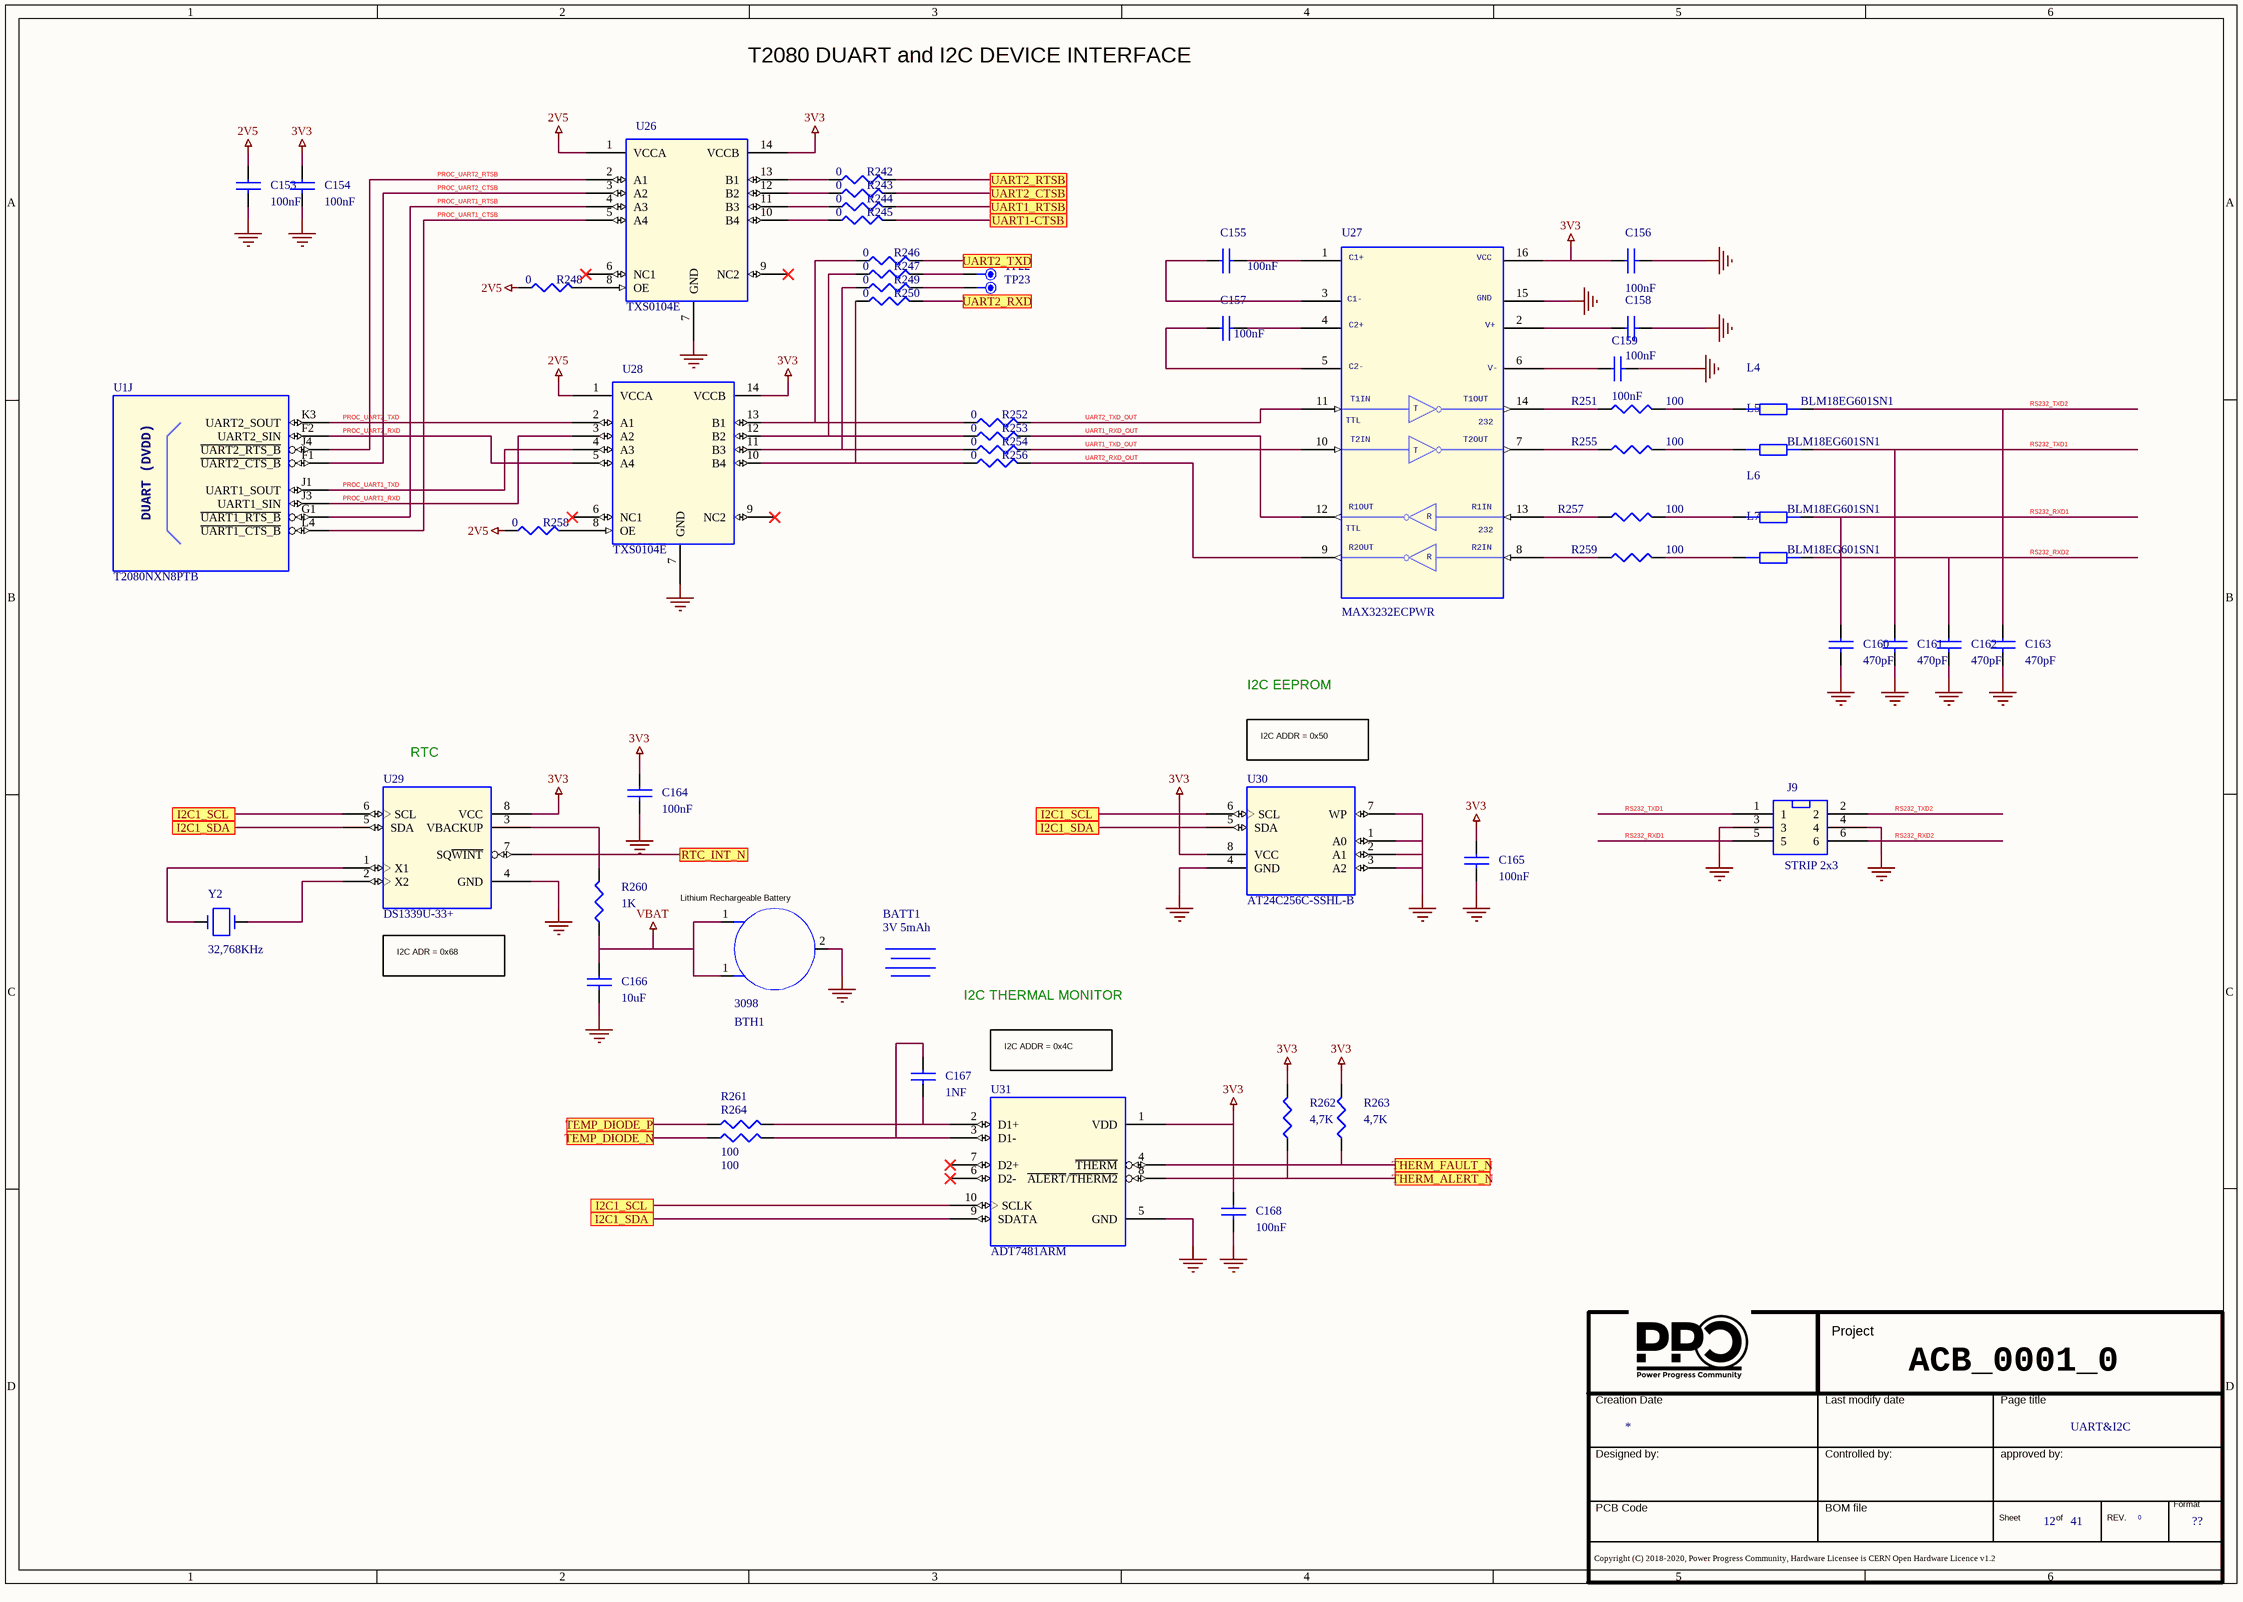
[diagram p22: 10 UART&I2C.SchDoc]

### Parts
(Parts that share a designator on the sheet are numbered #1, #2 ... from top to bottom, then left to right.)
*#15  Doc: UART&I2C  Page Count: 41  Page Number: 12  Page Size: ??  RevCode: 0  (hidden comment: Title_block_PPC)  (graphical)
BATT1  3V 5mAh
BTH1  3098  [SMD 3 PIN]
C153  100nF  [SMD_0402]
C154  100nF  [SMD_0402]
C155  100nF  [SMD_0402]
C156  100nF  [SMD_0402]
C157  100nF  [SMD_0402]
C158  100nF  [SMD_0402]
C159  100nF  [SMD_0402]
C160  470pF  [SMD_0402]
C161  470pF  [SMD_0402]
C162  470pF  [SMD_0402]
C163  470pF  [SMD_0402]
C164  100nF  [SMD_0402]
C165  100nF  [SMD_0402]
C166  10uF  [SMD_0603]
C167  1NF  [SMD_0402]
C168  100nF  [SMD_0402]
J9  STRIP 2x3  [SMT]
L4  BLM18EG601SN1  [SMD_0603]
L5  BLM18EG601SN1  [SMD_0603]
L6  BLM18EG601SN1  [SMD_0603]
L7  BLM18EG601SN1  [SMD_0603]
R242  0  [SMD_0402]
R243  0  [SMD_0402]
R244  0  [SMD_0402]
R245  0  [SMD_0402]
R246  0  [SMD_0402]
R247  0  [SMD_0402]
R248  0  [SMD_0402]
R249  0  [SMD_0402]
R250  0  [SMD_0402]
R251  100  [SMD_0402]
R252  0  [SMD_0402]
R253  0  [SMD_0402]
R254  0  [SMD_0402]
R255  100  [SMD_0402]
R256  0  [SMD_0402]
R257  100  [SMD_0402]
R258  0  [SMD_0402]
R259  100  [SMD_0402]
R260  1K  [SMD_0402]
R261  100  [SMD_0402]
R262  4,7K  [SMD_0402]
R263  4,7K  [SMD_0402]
R264  100  [SMD_0402]
TP22  TPS  [TPS]  (value not drawn)
TP23  TPS  [TPS]  (value not drawn)
U1  T2080NXN8PTB  [bga]  (part J of 14)
U26  TXS0104E  [TSSOP14]
U27  MAX3232ECPWR  [TSSOP16]
U28  TXS0104E  [TSSOP14]
U29  DS1339U-33+  [USOP8]
U30  AT24C256C-SSHL-B  [so_8]
U31  ADT7481ARM  [msop_10]
Y2  32,768KHz  [SMD_3215]

### Ports
I2C1_SCL, I2C1_SDA, RTC_INT_N, TEMP_DIODE_N, TEMP_DIODE_P, THERM_ALERT_N, THERM_FAULT_N, UART1-CTSB, UART1_RTSB, UART2_CTSB, UART2_RTSB, UART2_RXD, UART2_TXD

### Nets
2V5: C153.1 R248.2 R258.2 U26.1(VCCA) U28.1(VCCA)
3V3: C154.1 C156.1 C164.1 C165.1 C168.1 R262.2 R263.2 U26.14(VCCB) U27.16(VCC) U28.14(VCCB) U29.8(VCC) U30.8(VCC) U31.1(VDD)
GND: BTH1.2(2NEG) C153.2 C154.2 C156.2 C158.2 C159.2 C160.2 C161.2 C162.2 C163.2 C164.2 C165.2 C166.2 C168.2 J9.3 J9.4 U26.7(GND) U27.15(GND) U28.7(GND) U29.4(GND) U30.1(A0) U30.2(A1) U30.3(A2) U30.4(GND) U30.7(WP) U31.5(GND)
VBAT: BTH1.1(1POS) C166.1 R260.1
PROC_UART1_CTSB: U1.L4(~{UART1_CTS_B}) U26.5(A4)
PROC_UART1_RTSB: U1.G1(~{UART1_RTS_B}) U26.4(A3)
PROC_UART1_RXD: U1.J3(UART1_SIN) U28.3(A2)
PROC_UART1_TXD: U1.J1(UART1_SOUT) U28.4(A3)
PROC_UART2_CTSB: U1.F1(~{UART2_CTS_B}) U26.3(A2)
PROC_UART2_RTSB: U1.J4(~{UART2_RTS_B}) U26.2(A1)
PROC_UART2_RXD: U1.F2(UART2_SIN) U28.5(A4)
PROC_UART2_TXD: U1.K3(UART2_SOUT) U28.2(A1)
RS232_RXD1: C160.1 J9.5 L6.2
RS232_RXD2: C162.1 J9.6 L7.2
RS232_TXD1: C161.1 J9.1 L5.2
RS232_TXD2: C163.1 J9.2 L4.2
UART1_RXD_OUT: R253.1 U27.12
UART1_TXD_OUT: R254.1 U27.10
UART2_RXD_OUT: R256.1 U27.9
UART2_TXD_OUT: R252.1 U27.11
NetC155_1: C155.1 U27.3
NetC155_2: C155.2 U27.1
NetC157_1: C157.1 U27.5
NetC157_2: C157.2 U27.4
NetC158_1: C158.1 U27.2
NetC159_1: C159.1 U27.6
NetC167_1: C167.1 R264.2 U31.3(D1-)
NetC167_2: C167.2 R261.2 U31.2(D1+)
NetD25_CATHODE: R262.1 U31.8(~{ALERT}/~{THERM2}) ; port THERM_ALERT_N
NetJ15_22: R246.1 ; port UART2_TXD
NetJ15_32: R250.1 ; port UART2_RXD
NetJ15_34: R242.1 ; port UART2_RTSB
NetJ15_36: R243.1 ; port UART2_CTSB
NetL4_1: L4.1 R251.2
NetL5_1: L5.1 R255.2
NetL6_1: L6.1 R257.2
NetL7_1: L7.1 R259.2
NetR95_2: U29.7(SQ~{WINT}) ; port RTC_INT_N
NetR108_1: U29.5(SDA) U30.5(SDA) U31.9(SDATA) ; port I2C1_SDA
NetR109_1: U29.6(SCL) U30.6(SCL) U31.10(SCLK) ; port I2C1_SCL
NetR242_2: R242.2 U26.13(B1)
NetR243_2: R243.2 U26.12(B2)
NetR244_1: R244.1 ; port UART1_RTSB
NetR244_2: R244.2 U26.11(B3)
NetR245_1: R245.1 ; port UART1-CTSB
NetR245_2: R245.2 U26.10(B4)
NetR246_2: R246.2 R252.2 U28.13(B1)
NetR247_1: R247.1 TP22.1
NetR247_2: R247.2 R253.2 U28.12(B2)
NetR248_1: R248.1 U26.8(OE)
NetR249_1: R249.1 TP23.1
NetR249_2: R249.2 R254.2 U28.11(B3)
NetR250_2: R250.2 R256.2 U28.10(B4)
NetR251_1: R251.1 U27.14
NetR255_1: R255.1 U27.7
NetR257_1: R257.1 U27.13
NetR258_1: R258.1 U28.8(OE)
NetR259_1: R259.1 U27.8
NetR260_2: R260.2 U29.3(VBACKUP)
NetR261_1: R261.1 ; port TEMP_DIODE_P
NetR263_1: R263.1 U31.4(~{THERM}) ; port THERM_FAULT_N
NetR264_1: R264.1 ; port TEMP_DIODE_N
NetU29_1: U29.1(X1) Y2.1
NetU29_2: U29.2(X2) Y2.2

Not connected (* = marked no-connect by the designer): U26 6(NC1)* 9(NC2)*; U28 6(NC1)* 9(NC2)*; U31 6(D2-)* 7(D2+)*

### Notes on the sheet
- T2080 DUART and I2C DEVICE INTERFACE
- I2C EEPROM
- (near U29) RTC
- I2C ADDR = 0x50
- (near BTH1) Lithium Rechargeable Battery
- I2C ADR = 0x68
- I2C THERMAL MONITOR
- I2C ADDR = 0x4C
- ACB_0001_0
- (in symbol MAX3232E) C1+; C1-; C2+; V+; C2-; V-; T1IN; T1OUT; T; TTL; 232; T2IN; T2OUT; R1OUT; R1IN; R; R2OUT; R2IN
- (in symbol T2080, part J) DUART (DVDD)

### Library data of the parts
*#15 = Title_block_PPC: Title: T2080PCIe; Schematic Page Count: 45; Schematic Page Number: 14; Author: MICETEK; Page Create Date: March  8, 1995; Page Title: ?; Page Modify Date: *
BATT1 = BATT_BUTTON: BATTERY LITHIUM COIN 3V 6.8mm Rechargable; Part Number: DA CODIFICARE; Manufacturer 1: Panasonic - BSG; Manufacturer Part Number 1: ML-621S/ZTN; Part Type: BATTERIA; Distributor 1: DIGIKEY (P007-ND)
BTH1 = BATT_HOLDER_PTH_1: HOLDER 6.8mm COIN CELL HLD SMD; Manufacturer 1: Keystone Electronics; Part Number: DA CODIFICARE; RSM: BATT-BH3098; Distributor 1: FARNELL (1889421); Manufacturer Part Number 1: 3098; Part Type: BATTHOLDER\SMD; Tecno77: BATT-BH3098; PCB Footprint: SMD 3 PIN
C153-C155 C158 C159 C165 C168 = CAP NP_Dup2: COND.CER. 100NF 50V 0402 X7R SMD; Manufacturer Part Number 1: CGA2B3X7R1H104M050BD; Manufacturer 1: TDK; Part Number: PASSIVE_24; RSM: RC0402; PCB Footprint: SMD_0402; Part Type: Capacitors\Ceramic\SMD\0402
C156 C157 C164 = CAP NP_Dup2: COND.CER. 100NF 50V 0402 X7R SMD; Part Number: PASSIVE_24; Manufacturer 1: TDK; Manufacturer Part Number 1: CGA2B3X7R1H104M050BD; RSM: RC0402; PCB Footprint: SMD_0402; Part Type: Capacitors\Ceramic\SMD\0402
C160-C163 = CAP NP_Dup2: COND.CER. 470PF 50V 0402 NPO SMD; Part Number: PASSIVE_83; Manufacturer 1: Murata; Manufacturer Part Number 1: GRM1555C1H471JA01D; RSM: RC0402; PCB Footprint: SMD_0402; Part Type: Capacitors\Ceramic\SMD\0402
C166 = CAP NP_Dup2: COND.CER.10uF 0603 25V SMD; Manufacturer Part Number 1: CL10A106MA8NRNC; Manufacturer 1: SAMSUNG; Part Number: PASSIVE_124; RSM: RC0603; PCB Footprint: SMD_0603; Part Type: Capacitors\Ceramic\SMD\0603
C167 = CAP NP_Dup2: COND.CER. 1NF 50V 0402 X7R SMD; Manufacturer Part Number 1: GRM15XR71H102KA86D; Manufacturer 1: Murata; Part Number: PASSIVE_47; RSM: RC0402; PCB Footprint: SMD_0402; Part Type: Capacitors\Ceramic\SMD\0402
J9 = HEADER_2x3: STRIP MASC.2x3P CS.p=2.54mm; Part Number: CONNECTORS_488; Manufacturer 1: TE CONNECTIVITY / AMP; Manufacturer Part Number 1: 9689567RL; PCB Footprint: 2.54mm; RSM: PIN-100MLS-6DL; Part Type: Strip\Terminal
L4 L5 L7 = FERRITE_BEAD: FERRITE BEAD 600ohm 500mA 0603 SMD; Manufacturer Part Number 1: BLM18EG601SN1 SMD; Manufacturer 1: Murata; Part Number: PASSIVE_377; RSM: RC0603; PCB Footprint: SMD_0603; Part Type: Ferrite Beads\SMD\0603
L6 = FERRITE_BEAD: FERRITE BEAD 600ohm 500mA 0603 SMD; Part Number: PASSIVE_377; Manufacturer 1: Murata; Manufacturer Part Number 1: BLM18EG601SN1 SMD; RSM: RC0603; PCB Footprint: SMD_0603; Part Type: Ferrite Beads\SMD\0603
R242-R250 R258 = R_Dup8: RESIS.CHIP 0R 5% 0402 SMD; Manufacturer 1: ROYAL OHM; Part Number: PASSIVE_805; RSM: RC0402; Distributor 1: CAMEL ELETTRONICA SRL  #; Manufacturer Part Number 1: RESIS.CHIP 0R 5% 0402 SMD; Part Type: Resistors\Fixed\SMD\0402\5%; PCB Footprint: SMD_0402
R251 R255 R257 R259 = R_Dup5: RESIS.CHIP 100R 5% 0402 SMD; Manufacturer 1: ROYAL OHM; Part Number: PASSIVE_812; RSM: RC0402; PCB Footprint: SMD_0402; Manufacturer Part Number 1: RESIS.CHIP 100R 5% 0402 SMD; Part Type: Resistors\Fixed\SMD\0402\5%
R252-R254 R256 = R_Dup8: RESIS.CHIP 0R 5% 0402 SMD; Part Number: PASSIVE_805; Manufacturer 1: ROYAL OHM; RSM: RC0402; Part Type: Resistors\Fixed\SMD\0402\5%; Manufacturer Part Number 1: RESIS.CHIP 0R 5% 0402 SMD; Distributor 1: CAMEL ELETTRONICA SRL  #; PCB Footprint: SMD_0402
R260 = R_Dup5: RESIS.CHIP 1K 1% 0402 SMD; Part Number: PASSIVE_628; Manufacturer 1: ROYAL OHM; RSM: RC0402; PCB Footprint: SMD_0402; Part Type: Resistors\Fixed\SMD\0402\1%; Manufacturer Part Number 1: RESIS.CHIP 1K 1% 0402 SMD
R261 R264 = R_Dup5: RESIS.CHIP 100R 5% 0402 SMD; Part Number: PASSIVE_812; Manufacturer 1: ROYAL OHM; RSM: RC0402; PCB Footprint: SMD_0402; Part Type: Resistors\Fixed\SMD\0402\5%; Manufacturer Part Number 1: RESIS.CHIP 100R 5% 0402 SMD
R262 R263 = R_Dup5: RESIS.CHIP 4,7K 5% 0402 SMD; Part Number: PASSIVE_861; Manufacturer 1: ROYAL OHM; RSM: RC0402; Part Type: Resistors\Fixed\SMD\0402\5%; Manufacturer Part Number 1: RESIS.CHIP 4,7K 5% 0402 SMD; PCB Footprint: SMD_0402
TP22 TP23 = TPS_2: Test Point, .025 sq pin; Mfr_Part_Number: Cut From Strip; MFR_Name: Samtec; PCB Footprint: tp36; RSM: AE-TESTPOINT; Distributor_Part_Number: no parts needed
U1 = T2080: QRIQ MPU 1.87GT/s DDR3/3L 4x10GE; Part Number: MICROPROCESSOR_65; Manufacturer 1: NXP; Vendor: Freescale; PCB Footprint: BGA896; RSM: PBGA896-0_8MM-26X25; TYPE: IC; MPN: T2080; Part Type: 32 BIT; Manufacturer Part Number 1: T2080NXN8PTB; Distributor 1: MOUSER(841-T2080NXN8PTB)
U26 U28 = TXS0104E: BIDIRECTIONAL VOLTAGE-LEVEL TRANSLATOR; Manufacturer Part Number 1: TXS0104EPWR; Manufacturer 1: TEXAS; Part Number: LOGIC_264; RSM: TSSOP-14; Distributor 1: TI.COM; Part Type: TRANSLATOR; PCB Footprint: TSSOP14
U27 = MAX3232E: IC RS232 3V-5.5V DRVR 16-TSSOP; Part Number: LOGIC_60; Manufacturer 1: TEXAS; RSM: TSSOP-16; Part Type: Drivers\RS-232; PCB Footprint: TSSOP16; Manufacturer Part Number 1: MAX3232ECPWR; Distributor 1: DIGIKEY (296-19263-2-ND)
U29 = DS1339U: IC RTC CLK/CALENDAR I2C 8-USOP; Manufacturer 1: Maxim; Part Number: LOGIC_355; RSM: USOP-8; Distributor 1: DIGIKEY(DS1339U-33+-ND); Manufacturer Part Number 1: DS1339U-33+; PCB Footprint: USOP8; Part Type: RTC; Vendor: Maxim; TYPE: IC; MPN: DS1339U-33+
U30 = EEPROM-I2C: EEPROM 256K (32K X 8), 2-WI 1.8V; Manufacturer 1: MICROCHIP; Part Number: MEMORIES_105; RSM: SO-8; Vendor: Atmel; PCB Footprint: SOIC-8; Distributor 1: MOUSER(556-AT24C256C-SSHL-B); Manufacturer Part Number 1: AT24C256C-SSHL-B; Part Type: EEPROM; TYPE: IC; MPN: AT24C256C-SSHL-B
U31 = ADT7481: 2 CH TEMP SNSR/ALARM 2 WIRE; Manufacturer Part Number 1: ADT7481ARMZ-REEL; Manufacturer 1: ON Semi; Part Number: LOGIC_361; PCB Footprint: MSOP-10; Distributor 1: MOUSER(863-ADT7481ARMZ-REEL); Part Type: I2C\TEMP_SENSOR; TYPE: IC; MPN: ADT7481ARMZ-REEL; Vendor: ON Semi; RSM: MSOP-10
Y2 = CRYSTAL: CRYSTAL 32.768KHZ 12.5PF SMD; Part Number: MISC_129; Manufacturer 1: TXC; Manufacturer Part Number 1: 9HT10-32.768KBZF-T; RSM: XC-ABS07; Part Type: Quartz; Distributor 1: DIGIKEY(887-1573-1-ND); PCB Footprint: SMD_3215

## Sheet 11 Proc Pwr1.SchDoc
size 420 x 297 mm
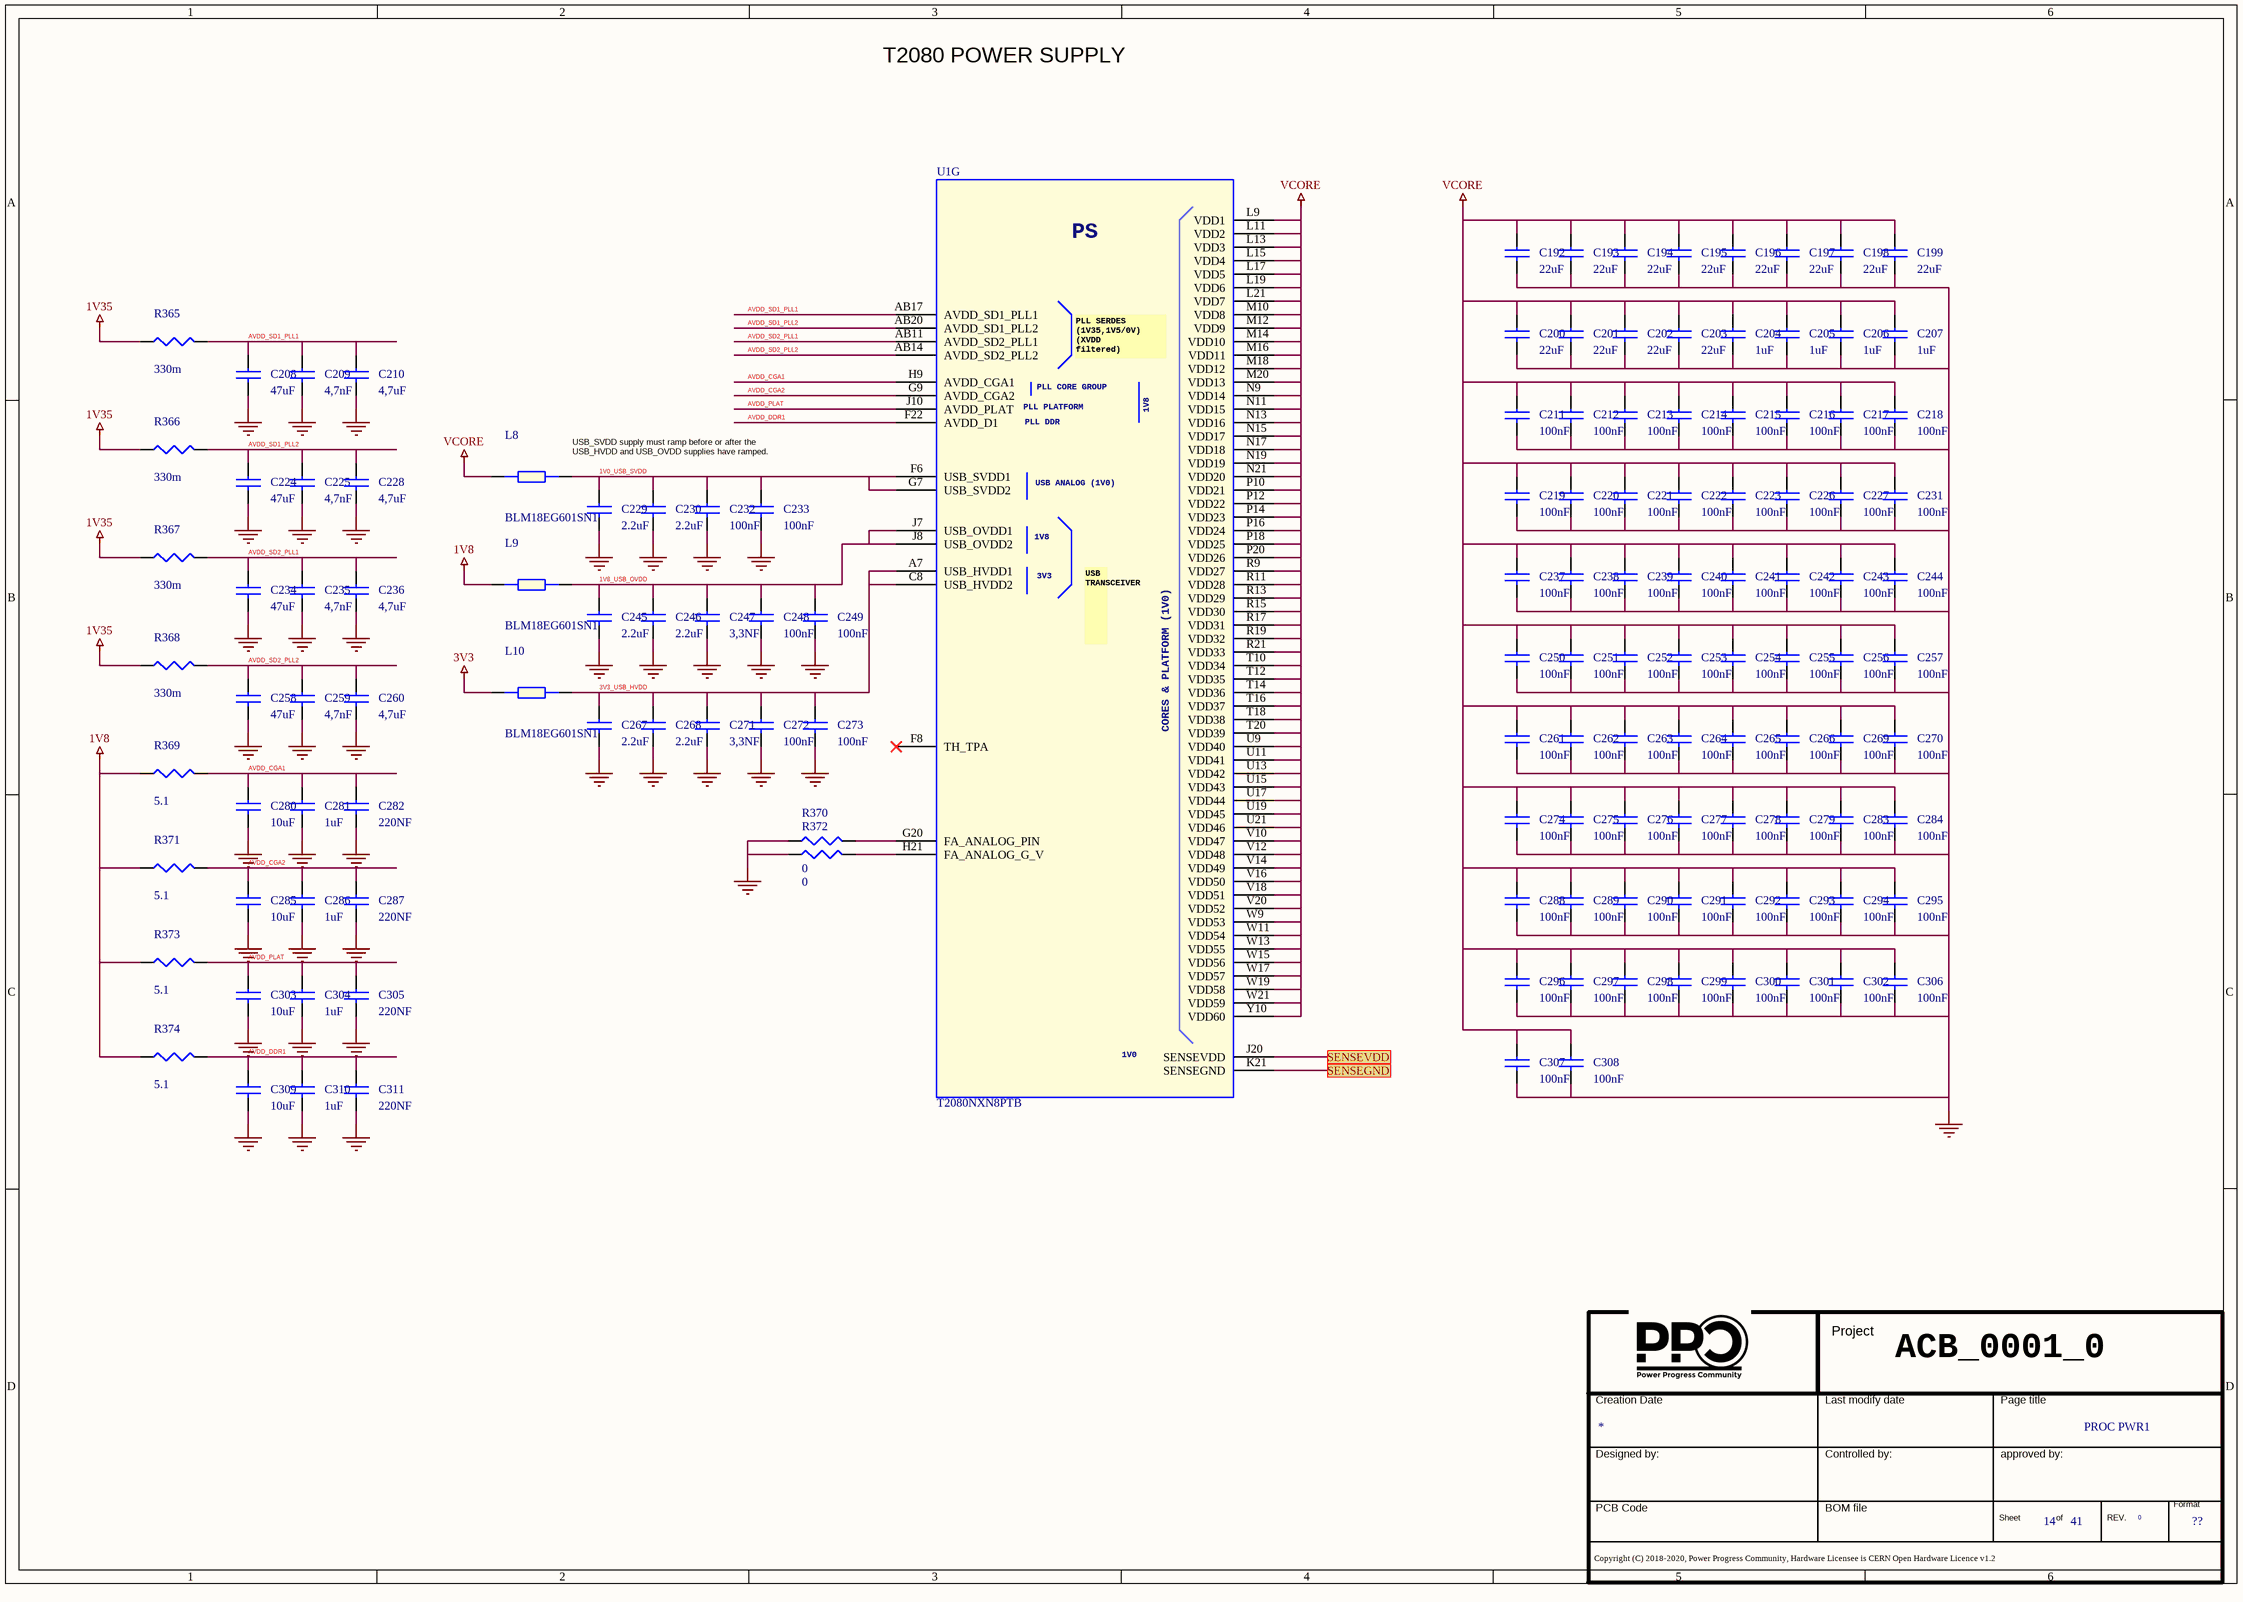
[diagram p23: 11 Proc Pwr1.SchDoc]

### Parts
(Parts that share a designator on the sheet are numbered #1, #2 ... from top to bottom, then left to right.)
*#16  Doc: PROC PWR1  Page Count: 41  Page Number: 14  Page Size: ??  RevCode: 0  (hidden comment: Title_block_PPC)  (graphical)
C192  22uF  [SMD_0805]
C193  22uF  [SMD_0805]
C194  22uF  [SMD_0805]
C195  22uF  [SMD_0805]
C196  22uF  [SMD_0805]
C197  22uF  [SMD_0805]
C198  22uF  [SMD_0805]
C199  22uF  [SMD_0805]
C200  22uF  [SMD_0805]
C201  22uF  [SMD_0805]
C202  22uF  [SMD_0805]
C203  22uF  [SMD_0805]
C204  1uF  [SMD_0402]
C205  1uF  [SMD_0402]
C206  1uF  [SMD_0402]
C207  1uF  [SMD_0402]
C208  47uF  [SMD_0805]
C209  4,7nF  [SMD_0402]
C210  4,7uF  [SMD_0603]
C211  100nF  [SMD_0603]
C212  100nF  [SMD_0603]
C213  100nF  [SMD_0201]
C214  100nF  [SMD_0603]
C215  100nF  [SMD_0603]
C216  100nF  [SMD_0603]
C217  100nF  [SMD_0603]
C218  100nF  [SMD_0603]
C219  100nF  [SMD_0201]
C220  100nF  [SMD_0201]
C221  100nF  [SMD_0603]
C222  100nF  [SMD_0201]
C223  100nF  [SMD_0201]
C224  47uF  [SMD_0805]
C225  4,7nF  [SMD_0402]
C226  100nF  [SMD_0603]
C227  100nF  [SMD_0603]
C228  4,7uF  [SMD_0603]
C229  2.2uF  [SMD_0402]
C230  2.2uF  [SMD_0402]
C231  100nF  [SMD_0603]
C232  100nF  [SMD_0603]
C233  100nF  [SMD_0603]
C234  47uF  [SMD_0805]
C235  4,7nF  [SMD_0402]
C236  4,7uF  [SMD_0603]
C237  100nF  [SMD_0201]
C238  100nF  [SMD_0201]
C239  100nF  [SMD_0201]
C240  100nF  [SMD_0201]
C241  100nF  [SMD_0201]
C242  100nF  [SMD_0201]
C243  100nF  [SMD_0201]
C244  100nF  [SMD_0201]
C245  2.2uF  [SMD_0402]
C246  2.2uF  [SMD_0402]
C247  3,3NF  [SMD_0402]
C248  100nF  [SMD_0603]
C249  100nF  [SMD_0603]
C250  100nF  [SMD_0201]
C251  100nF  [SMD_0201]
C252  100nF  [SMD_0201]
C253  100nF  [SMD_0201]
C254  100nF  [SMD_0201]
C255  100nF  [SMD_0201]
C256  100nF  [SMD_0201]
C257  100nF  [SMD_0201]
C258  47uF  [SMD_0805]
C259  4,7nF  [SMD_0402]
C260  4,7uF  [SMD_0603]
C261  100nF  [SMD_0201]
C262  100nF  [SMD_0201]
C263  100nF  [SMD_0201]
C264  100nF  [SMD_0201]
C265  100nF  [SMD_0201]
C266  100nF  [SMD_0201]
C267  2.2uF  [SMD_0402]
C268  2.2uF  [SMD_0402]
C269  100nF  [SMD_0201]
C270  100nF  [SMD_0201]
C271  3,3NF  [SMD_0402]
C272  100nF  [SMD_0603]
C273  100nF  [SMD_0603]
C274  100nF  [SMD_0201]
C275  100nF  [SMD_0201]
C276  100nF  [SMD_0201]
C277  100nF  [SMD_0201]
C278  100nF  [SMD_0201]
C279  100nF  [SMD_0201]
C280  10uF  [SMD_0603]
C281  1uF  [SMD_0402]
C282  220NF  [SMD_0402]
C283  100nF  [SMD_0201]
C284  100nF  [SMD_0201]
C285  10uF  [SMD_0603]
C286  1uF  [SMD_0402]
C287  220NF  [SMD_0402]
C288  100nF  [SMD_0201]
C289  100nF  [SMD_0201]
C290  100nF  [SMD_0201]
C291  100nF  [SMD_0201]
C292  100nF  [SMD_0201]
C293  100nF  [SMD_0201]
C294  100nF  [SMD_0201]
C295  100nF  [SMD_0201]
C296  100nF  [SMD_0201]
C297  100nF  [SMD_0201]
C298  100nF  [SMD_0201]
C299  100nF  [SMD_0201]
C300  100nF  [SMD_0201]
C301  100nF  [SMD_0201]
C302  100nF  [SMD_0201]
C303  10uF  [SMD_0603]
C304  1uF  [SMD_0402]
C305  220NF  [SMD_0402]
C306  100nF  [SMD_0201]
C307  100nF  [SMD_0201]
C308  100nF  [SMD_0201]
C309  10uF  [SMD_0603]
C310  1uF  [SMD_0402]
C311  220NF  [SMD_0402]
L8  BLM18EG601SN1  [SMD_0603]
L9  BLM18EG601SN1  [SMD_0603]
L10  BLM18EG601SN1  [SMD_0603]
R365  330m  [SMD_0402]
R366  330m  [SMD_0402]
R367  330m  [SMD_0402]
R368  330m  [SMD_0402]
R369  5.1  [SMD_0402]
R370  0  [SMD_0402]
R371  5.1  [SMD_0402]
R372  0  [SMD_0402]
R373  5.1  [SMD_0402]
R374  5.1  [SMD_0402]
U1  T2080NXN8PTB  [bga]  (part G of 14)

### Ports
SENSEGND, SENSEVDD

### Nets
1V8: L9.1 R369.1 R371.1 R373.1 R374.1
1V35: R365.1 R366.1 R367.1 R368.1
3V3: L10.1
GND: C192.2 C193.2 C194.2 C195.2 C196.2 C197.2 C198.2 C199.2 C200.2 C201.2 C202.2 C203.2 C204.2 C205.2 C206.2 C207.2 C208.2 C209.2 C210.2 C211.2 C212.2 C213.2 C214.2 C215.2 C216.2 C217.2 C218.2 C219.2 C220.2 C221.2 C222.2 C223.2 C224.2 C225.2 C226.2 C227.2 C228.2 C229.2 C230.2 C231.2 C232.2 C233.2 C234.2 C235.2 C236.2 C237.2 C238.2 C239.2 C240.2 C241.2 C242.2 C243.2 C244.2 C245.2 C246.2 C247.2 C248.2 C249.2 C250.2 C251.2 C252.2 C253.2 C254.2 C255.2 C256.2 C257.2 C258.2 C259.2 C260.2 C261.2 C262.2 C263.2 C264.2 C265.2 C266.2 C267.2 C268.2 C269.2 C270.2 C271.2 C272.2 C273.2 C274.2 C275.2 C276.2 C277.2 C278.2 C279.2 C280.2 C281.2 C282.2 C283.2 C284.2 C285.2 C286.2 C287.2 C288.2 C289.2 C290.2 C291.2 C292.2 C293.2 C294.2 C295.2 C296.2 C297.2 C298.2 C299.2 C300.2 C301.2 C302.2 C303.2 C304.2 C305.2 C306.2 C307.2 C308.2 C309.2 C310.2 C311.2 R370.1 R372.1
VCORE: C192.1 C193.1 C194.1 C195.1 C196.1 C197.1 C198.1 C199.1 C200.1 C201.1 C202.1 C203.1 C204.1 C205.1 C206.1 C207.1 C211.1 C212.1 C213.1 C214.1 C215.1 C216.1 C217.1 C218.1 C219.1 C220.1 C221.1 C222.1 C223.1 C226.1 C227.1 C231.1 C237.1 C238.1 C239.1 C240.1 C241.1 C242.1 C243.1 C244.1 C250.1 C251.1 C252.1 C253.1 C254.1 C255.1 C256.1 C257.1 C261.1 C262.1 C263.1 C264.1 C265.1 C266.1 C269.1 C270.1 C274.1 C275.1 C276.1 C277.1 C278.1 C279.1 C283.1 C284.1 C288.1 C289.1 C290.1 C291.1 C292.1 C293.1 C294.1 C295.1 C296.1 C297.1 C298.1 C299.1 C300.1 C301.1 C302.1 C306.1 C307.1 C308.1 L8.1 U1.L9(VDD1) U1.L11(VDD2) U1.L13(VDD3) U1.L15(VDD4) U1.L17(VDD5) U1.L19(VDD6) U1.L21(VDD7) U1.M10(VDD8) U1.M12(VDD9) U1.M14(VDD10) U1.M16(VDD11) U1.M18(VDD12) U1.M20(VDD13) U1.N9(VDD14) U1.N11(VDD15) U1.N13(VDD16) U1.N15(VDD17) U1.N17(VDD18) U1.N19(VDD19) U1.N21(VDD20) U1.P10(VDD21) U1.P12(VDD22) U1.P14(VDD23) U1.P16(VDD24) U1.P18(VDD25) U1.P20(VDD26) U1.R9(VDD27) U1.R11(VDD28) U1.R13(VDD29) U1.R15(VDD30) U1.R17(VDD31) U1.R19(VDD32) U1.R21(VDD33) U1.T10(VDD34) U1.T12(VDD35) U1.T14(VDD36) U1.T16(VDD37) U1.T18(VDD38) U1.T20(VDD39) U1.U9(VDD40) U1.U11(VDD41) U1.U13(VDD42) U1.U15(VDD43) U1.U17(VDD44) U1.U19(VDD45) U1.U21(VDD46) U1.V10(VDD47) U1.V12(VDD48) U1.V14(VDD49) U1.V16(VDD50) U1.V18(VDD51) U1.V20(VDD52) U1.W9(VDD53) U1.W11(VDD54) U1.W13(VDD55) U1.W15(VDD56) U1.W17(VDD57) U1.W19(VDD58) U1.W21(VDD59) U1.Y10(VDD60)
1V0_USB_SVDD: C229.1 C230.1 C232.1 C233.1 L8.2 U1.F6(USB_SVDD1) U1.G7(USB_SVDD2)
1V8_USB_OVDD: C245.1 C246.1 C247.1 C248.1 C249.1 L9.2 U1.J7(USB_OVDD1) U1.J8(USB_OVDD2)
3V3_USB_HVDD: C267.1 C268.1 C271.1 C272.1 C273.1 L10.2 U1.A7(USB_HVDD1) U1.C8(USB_HVDD2)
AVDD_CGA1: C280.1 C281.1 C282.1 R369.2 U1.H9(AVDD_CGA1)
AVDD_CGA2: C285.1 C286.1 C287.1 R371.2 U1.G9(AVDD_CGA2)
AVDD_DDR1: C309.1 C310.1 C311.1 R374.2 U1.F22(AVDD_D1)
AVDD_PLAT: C303.1 C304.1 C305.1 R373.2 U1.J10(AVDD_PLAT)
AVDD_SD1_PLL1: C208.1 C209.1 C210.1 R365.2 U1.AB17(AVDD_SD1_PLL1)
AVDD_SD1_PLL2: C224.1 C225.1 C228.1 R366.2 U1.AB20(AVDD_SD1_PLL2)
AVDD_SD2_PLL1: C234.1 C235.1 C236.1 R367.2 U1.AB11(AVDD_SD2_PLL1)
AVDD_SD2_PLL2: C258.1 C259.1 C260.1 R368.2 U1.AB14(AVDD_SD2_PLL2)
NetR370_2: R370.2 U1.G20(FA_ANALOG_PIN)
NetR372_2: R372.2 U1.H21(FA_ANALOG_G_V)
NetR736_2: U1.J20(SENSEVDD) ; port SENSEVDD
NetR737_2: U1.K21(SENSEGND) ; port SENSEGND

Not connected (* = marked no-connect by the designer): U1 F8(TH_TPA)*

### Notes on the sheet
- T2080 POWER SUPPLY
- (near L8) USB_SVDD supply must ramp before or after the
  USB_HVDD and USB_OVDD supplies have ramped.
- ACB_0001_0
- (in symbol T2080, part G) PS; PLL SERDES / (1V35,1V5/0V) / (XVDD / filtered); PLL CORE GROUP; PLL PLATFORM; 1V8; PLL DDR; USB ANALOG (1V0); 3V3; USB / TRANSCEIVER; CORES & PLATFORM (1V0); 1V0

### Library data of the parts
*#16 = Title_block_PPC: Title: T2080PCIe; Schematic Page Count: 45; Schematic Page Number: 16; Author: MICETEK; Page Create Date: March  8, 1995; Page Title: ?; Page Modify Date: *
C192-C203 = CAP NP_Dup2: 22UF 35V 20% 0805; Manufacturer Part Number 1: C2012X5R1V226M125AC; Manufacturer 1: TDK; Part Number: PASSIVE_224; RSM: RC0805; PCB Footprint: SMD_0805; Part Type: Capacitors\Ceramic\SMD\0805
C204-C207 C281 C286 C304 C310 = CAP NP_Dup2: CAP CER 1UF 25V X6S 0402; Manufacturer Part Number 1: GRM155C81E105KE11D; Manufacturer 1: Murata; Part Number: PASSIVE_1446; RSM: RC0402; PCB Footprint: SMD_0402; Part Type: Capacitors\Ceramic\SMD\0402
C208 C224 C234 C258 = CAP NP_Dup2: CAP CER 47UF 10V 20% X5R 0805; Manufacturer Part Number 1: JMK212BJ476MG-T; Manufacturer 1: Taiyo Yuden; Part Number: PASSIVE_244; RSM: RC0805; PCB Footprint: SMD_0805; Part Type: Capacitors\Ceramic\SMD\0805
C209 C225 C235 C259 = CAP NP_Dup2: COND.CER. 4,7nF 50V 0402 X7R SMD; Manufacturer Part Number 1: GRM155R71H472KA01D; Manufacturer 1: Murata; Part Number: PASSIVE_78; RSM: RC0402; PCB Footprint: SMD_0402; Part Type: Capacitors\Ceramic\SMD\0402
C210 C228 C236 C260 = CAP NP_Dup2: COND.CER.4,7uF 16V X5R 0603 SMD; Manufacturer Part Number 1: CL10A475KO8NNNC; Manufacturer 1: SAMSUNG; Part Number: PASSIVE_1405; RSM: RC0603; PCB Footprint: SMD_0603; Part Type: Capacitors\Ceramic\SMD\0603
C211 C212 C214-C218 C221 C226 C227 C231-C233 C248 C249 C272 C273 = CAP NP_Dup2: COND.CER.100NF 50V 0603 X7R SMD; Manufacturer Part Number 1: ECJ1VB1H104K; Manufacturer 1: PANASONIC; Part Number: PASSIVE_118; RSM: RC0603; PCB Footprint: SMD_0603; Part Type: Capacitors\Ceramic\SMD\0603
C213 C219 C220 C237-C244 C253-C257 C261-C266 C269 C270 = CAP NP_Dup2: CAP CER 0.1UF 6.3V 20% X5R 0201; Manufacturer Part Number 1: C0603X5R0J104M030BC; Manufacturer 1: TDK; Part Number: PASSIVE_3; RSM: RC0201; PCB Footprint: SMD_0201; Part Type: Capacitors\Ceramic\SMD\0201
C222 C223 C250-C252 C274-C279 C283 C284 C288-C302 C306-C308 = CAP NP_Dup2: LCC - SMD/SMT 0201 0.1uF 10volts X7S +/-10%; Part Number: PASSIVE_2; Manufacturer 1: TDK; Manufacturer Part Number 1: C0603X7S1A104K030BC; RSM: RC0201; Part Type: Capacitors\Ceramic\SMD\0201; PCB Footprint: SMD_0201
C229 C230 C245 C246 C267 C268 = CAP NP_Dup2: CAP CER 2.2UF 25V X5R 0402; Manufacturer Part Number 1: GRM155R61E225ME15D; Manufacturer 1: Murata; Part Number: PASSIVE_1448; RSM: RC0402; PCB Footprint: SMD_0402; Part Type: Capacitors\Ceramic\SMD\0402
C247 C271 = CAP NP_Dup2: COND.CER. 3,3NF 50V 0402 X7R SMD; Part Number: PASSIVE_69; RSM: RC0402; PCB Footprint: SMD_0402; Part Type: Capacitors\Ceramic\SMD\0402
C280 C285 C303 C309 = CAP NP_Dup2: as C166 on sheet 10 UART&I2C; PCB Footprint: SMD_0603; Part Type: Capacitors\Ceramic\SMD\0603
C282 C287 C305 C311 = CAP NP_Dup2: COND.CER. 220NF 10V 0402 X7R SMD; Part Number: PASSIVE_59; Manufacturer 1: Murata; Manufacturer Part Number 1: GRM155R61A224KE19; RSM: RC0402; Part Type: Capacitors\Ceramic\SMD\0402; PCB Footprint: SMD_0402
L8-L10 = FERRITE_BEAD: as L6 on sheet 10 UART&I2C; PCB Footprint: SMD_0603; Part Type: Ferrite Beads\SMD\0603
R365-R368 = R_Dup5: Resistori rilevatori di corrente - SMD 1/8watt .33ohms 1%; Manufacturer Part Number 1: RCWE0402R330FKEA; Manufacturer 1: VISHAY DALE; Part Number: PASSIVE_1464; RSM: RC0402; PCB Footprint: SMD_0402; Part Type: Resistors\Fixed\SMD\0603\1%
R369 R371 R373 R374 = R_Dup5: RESIS.CHIP 5,1 1% 0402 SMD; Part Number: PASSIVE_747; Manufacturer 1: YAGEO; Manufacturer Part Number 1: RES SMD 5.1 OHM 1% 1/16W 0402; RSM: RC0402; PCB Footprint: SMD_0402; Part Type: Resistors\Fixed\SMD\0402\1%
R370 R372 = R_Dup5: as R270 on sheet 10B_WRAPPER; PCB Footprint: SMD_0402; Part Type: Resistors\Fixed\SMD\0402\5%; Manufacturer Part Number 1: RESIS.CHIP 0R 5% 0402 SMD
U1 = T2080: QRIQ MPU 1.87GT/s DDR3/3L 4x10GE; Part Number: MICROPROCESSOR_65; Manufacturer 1: NXP; Vendor: Freescale; PCB Footprint: BGA896; RSM: PBGA896-0_8MM-25X25; TYPE: IC; MPN: T2080; Part Type: 32 BIT; Manufacturer Part Number 1: T2080NXN8PTB; Distributor 1: MOUSER(841-T2080NXN8PTB)